# EasyEDA Pro project ProPrj_IRIS_2026-04-30.epro, board PCB1
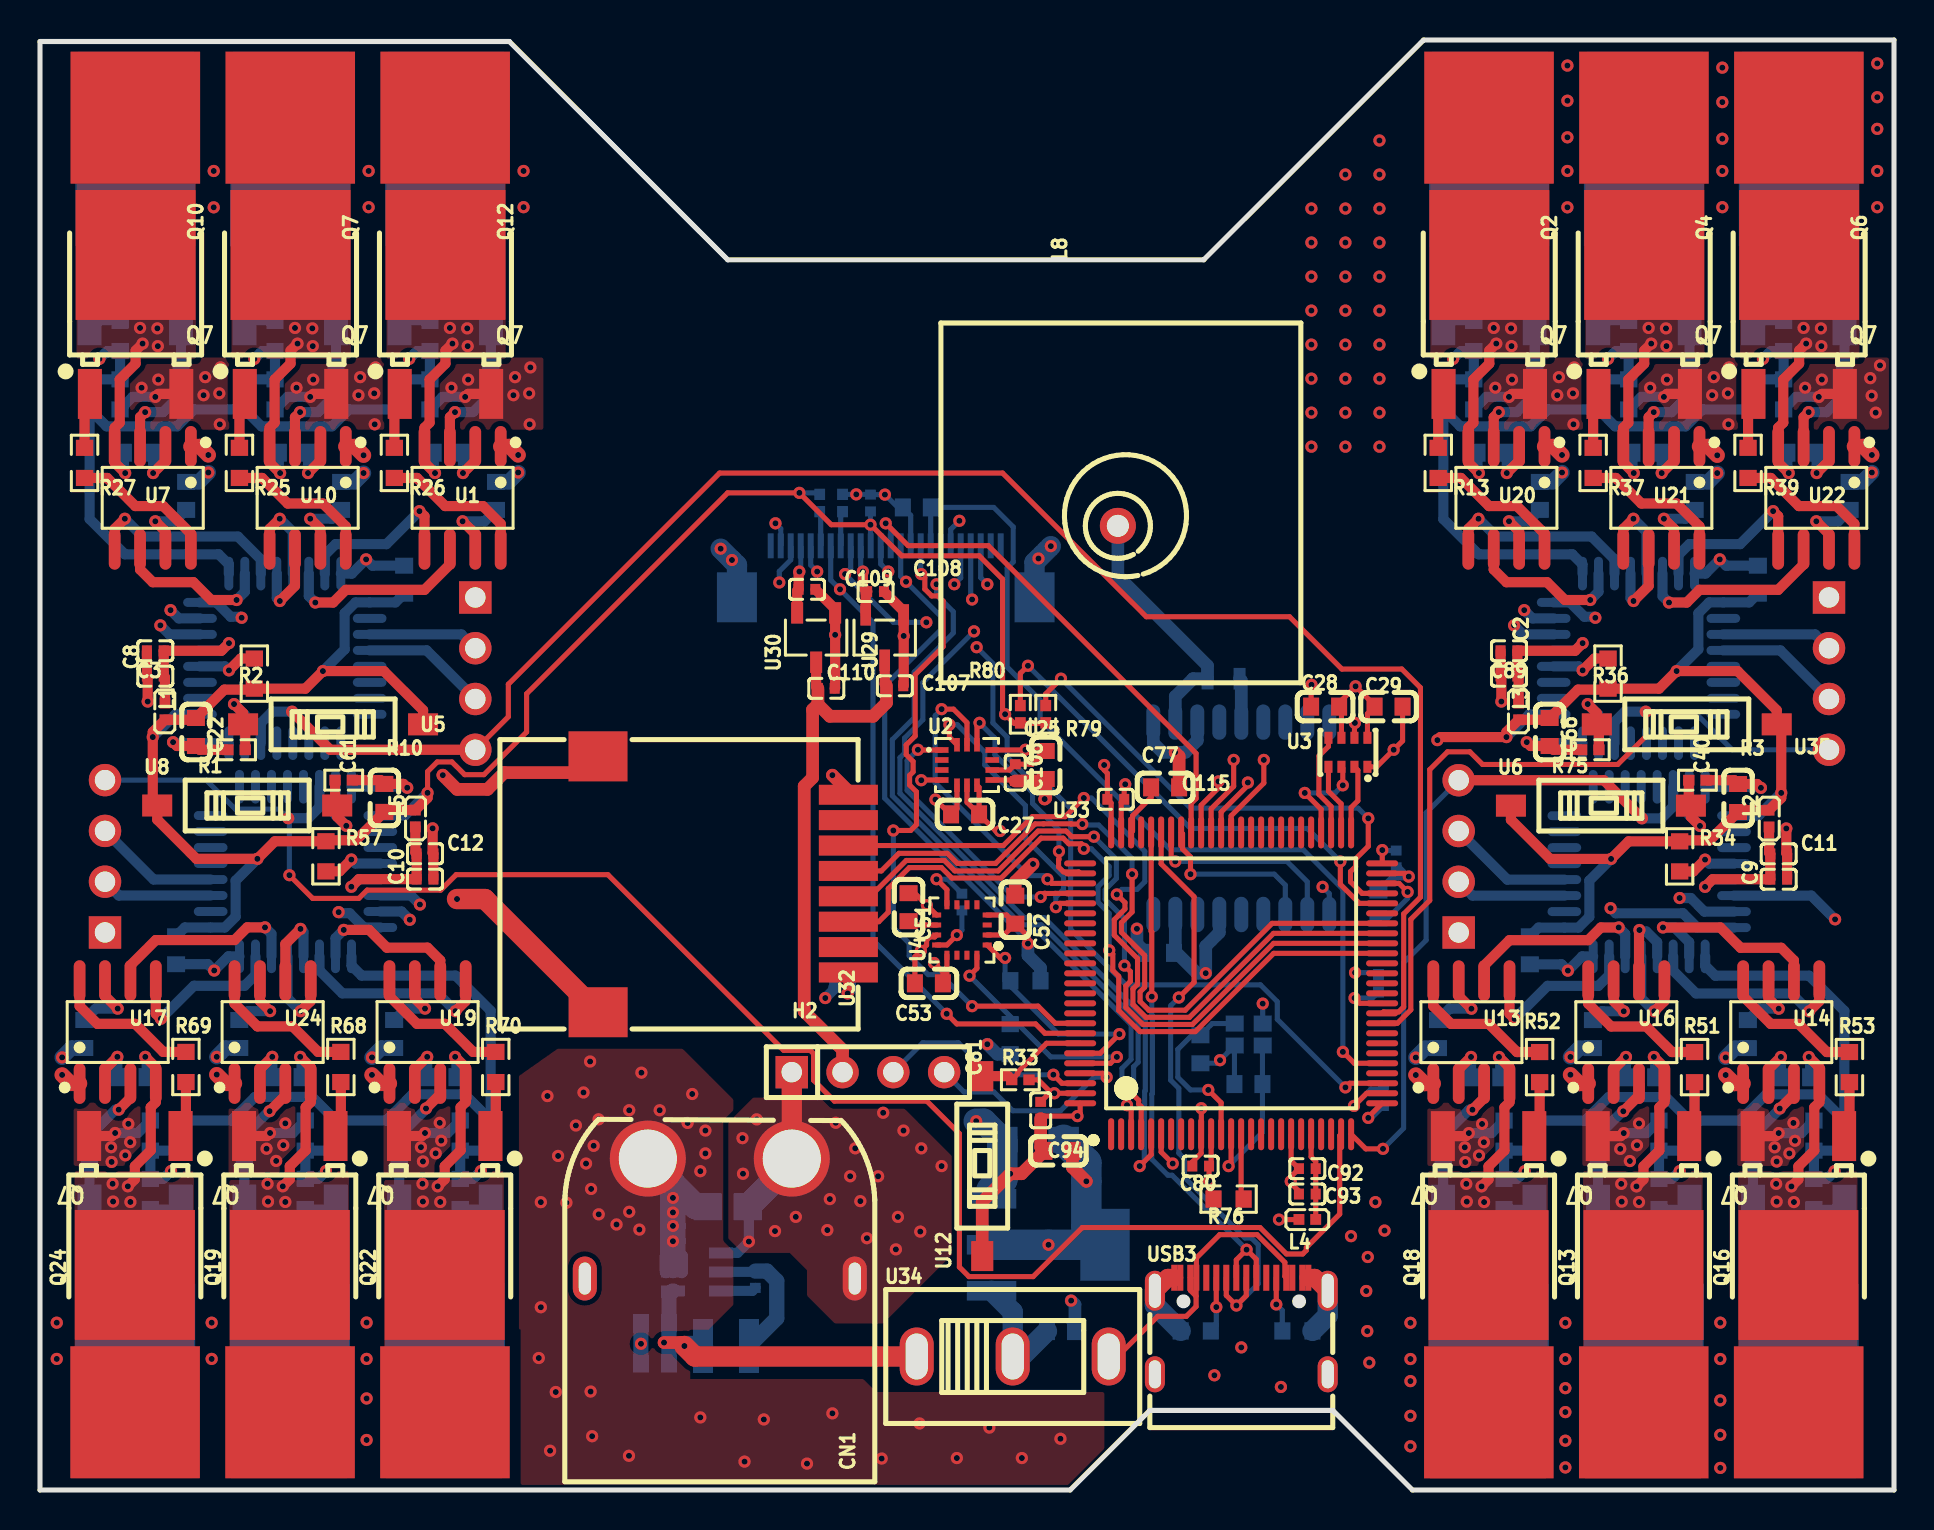
[diagram p2: board, top side]
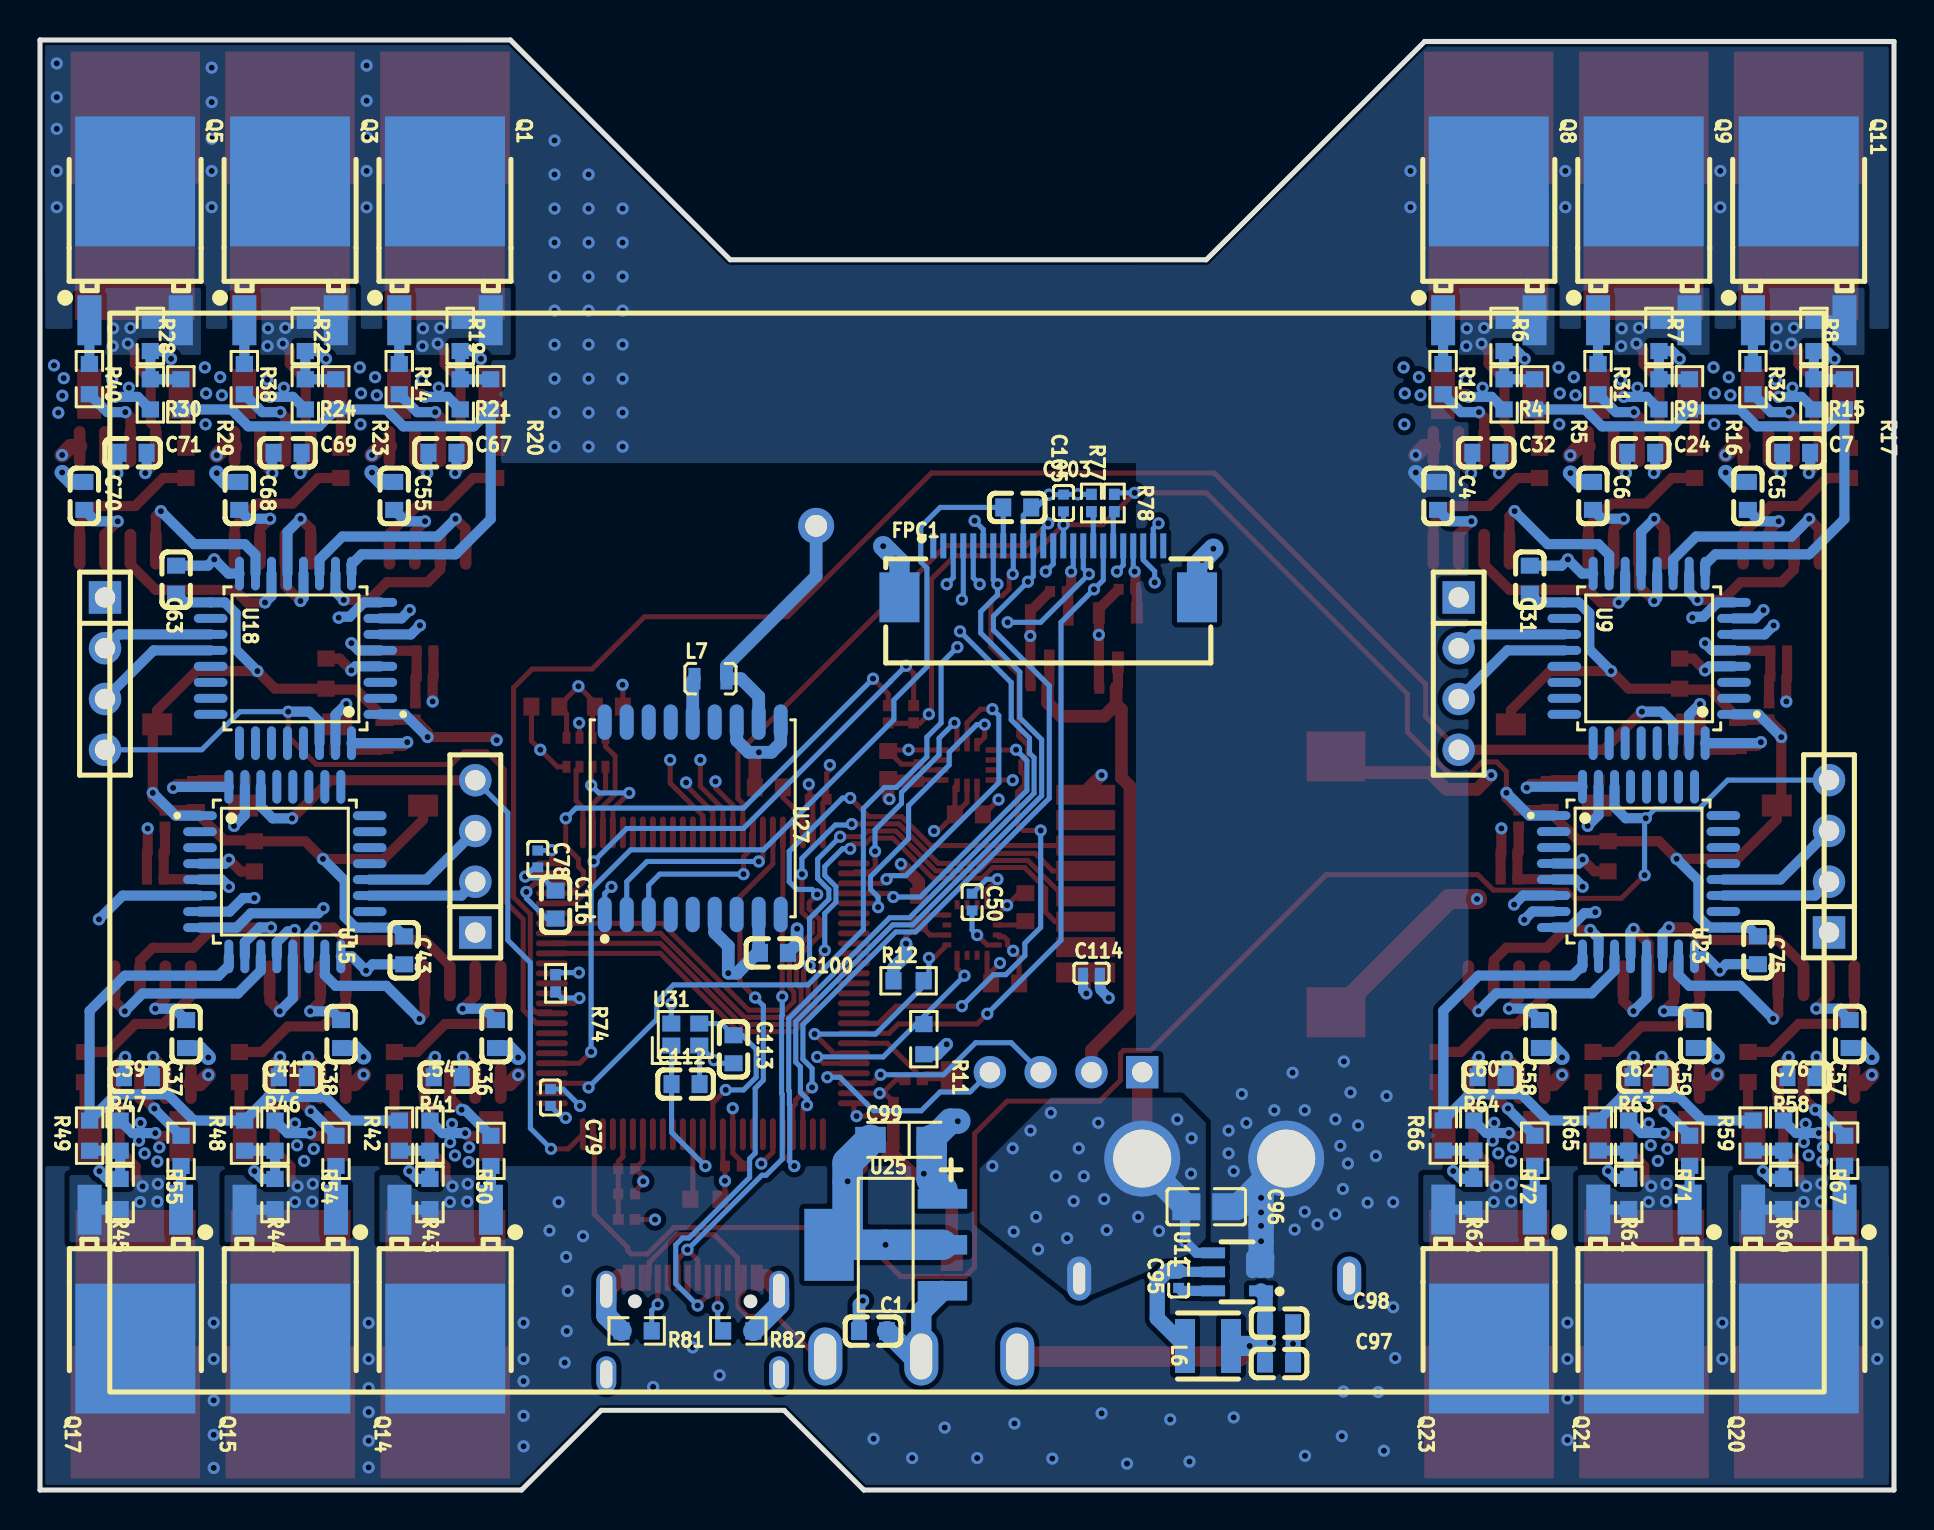
[diagram p3: board, bottom side, seen from below]

Outline 92.71 x 72.54 mm; copper layers: Top Layer, Ground, Power, Bottom Layer. Coordinates in mm from the lower left corner of the outline.
Outline path: 0,72.47 0,0 51.51,0 55.5,3.99 64.64,3.99 68.63,0 92.71,0 92.71,72.54 69.19,72.54 58.19,61.54 34.39,61.54 23.47,72.47 0,72.47
Stack: Top Layer 0.035mm Outer layer thickness 1oz / Dielectric1 0.2104mm 7628 RC49% 8.6mil / Ground 0.0152mm Inner layer thickness / Dielectric2 1.065mm 1.1mm H/HOZ Copper / Power 0.0152mm Inner layer thickness / Dielectric3 0.2104mm 7628 RC49% 8.6mil / Bottom Layer 0.035mm Outer layer thickness 1oz

## Design rules (mm)
template: Custom Config
spacing copperThickness1oz (default): track to track 0.102, other pairs 0.152 to 0.3
spacing copperThickness2oz: track to track 0.203, other pairs 0.152 to 0.3
track width copperThickness1oz (default): min 0.127, default 0.254, max 2.54
track width copperThickness2oz: min 0.203, default 0.254, max 2.54
differential pair differentialPair (default): width min 0.127, default 0.254, max 2.54; gap min 0.152, default 0.152
via viaSize (default): diameter min 0.5, default 0.61, max 10; hole min 0.3, default 0.305, max 6.3
net $1I45112\PHASE_U uses copperRegion1
net $1I45112\PHASE_V uses copperRegion1
net $1I45112\PHASE_W uses copperRegion1
net $1I45134\PHASE_U uses copperRegion1
net $1I45134\PHASE_V uses copperRegion1
net 7.4V_BATTERY uses copperRegion1
net $1I45134\PHASE_W uses copperRegion1
net $1I45156\PHASE_U uses copperRegion1
net $1I45156\PHASE_V uses copperRegion1
net $1I45090\PHASE_U uses copperRegion1
net $1I45090\PHASE_V uses copperRegion1
net $1I45090\PHASE_W uses copperRegion1
net $1I45156\PHASE_W uses copperRegion1
pour e4111 uses copperRegion1
pour e397 uses copperRegion1
pour e182 uses copperRegion1
pour e292 uses copperRegion1
pour e393 uses copperRegion1
pour e1338 uses copperRegion1
pour e470 uses copperRegion1
pour e582 uses copperRegion1
pour e701 uses copperRegion1
pour e838 uses copperRegion1
pour e2081 uses copperRegion1
pour e2207 uses copperRegion1
pour e2186 uses copperRegion1
pour e2269 uses copperRegion1
pour e2267 uses copperRegion1
pour e2268 uses copperRegion1
pour e2460 uses copperRegion1
pour e2478 uses copperRegion1
pour e2486 uses copperRegion1
pour e2530 uses copperRegion1
pour e2531 uses copperRegion1
pour e2532 uses copperRegion1

## Placement (name value [footprint] x y rotation side)
C1  10uF  [C0603]  51.05 7.95 180 bottom
C2  1uF  [C0402]  73.46 41.99 0 top
C3  100nF  [C0402]  5.77 40.72 180 top
C4  10uF  [C0603]  22.8 49.73 90 bottom
C5  10uF  [C0603]  7.31 49.73 90 bottom
C6  10uF  [C0603]  15.05 49.73 90 bottom
C7  100nF  [C0603]  4.89 51.89 0 bottom
C8  1uF  [C0402]  5.77 41.99 0 top
C9  1uF  [C0402]  86.94 30.56 180 top
C10  1uF  [C0402]  19.25 30.56 180 top
C11  100nF  [C0402]  86.94 31.83 0 top
C12  100nF  [C0402]  19.25 31.83 0 top
C22  100nF  [C0603]  7.8 37.92 90 top
C24  100nF  [C0603]  12.64 51.89 0 bottom
C25  2.2uF  [C0603]  50.29 36.27 270 top
C27  10nF  [C0603]  46.26 33.8 180 top
C28  100nF  [C0603]  64.26 39.19 180 top
C29  100nF  [C0603]  67.44 39.19 0 top
C31  100nF  [C0603]  18.21 45.54 90 bottom
C32  100nF  [C0603]  20.39 51.89 0 bottom
C36  10uF  [C0603]  69.91 22.81 270 bottom
C37  10uF  [C0603]  85.4 22.81 270 bottom
C38  10uF  [C0603]  77.66 22.81 270 bottom
C39  100nF  [C0603]  87.82 20.65 180 bottom
C40  100nF  [C0603]  84.91 34.62 270 top
C41  100nF  [C0603]  80.07 20.65 180 bottom
C43  100nF  [C0603]  74.5 27 270 bottom
C50  220nF  [C0402]  46.1 29.41 270 bottom
C51  4.7uF  [C0603]  43.43 29.16 90 top
C52  100nF  [C0603]  48.77 29.03 90 top
C53  100nF  [C0603]  44.45 25.35 180 top
C54  100nF  [C0603]  72.32 20.65 180 bottom
C55  10uF  [C0603]  75 49.73 90 bottom
C57  10uF  [C0603]  2.22 22.81 270 bottom
C58  10uF  [C0603]  17.71 22.81 270 bottom
C59  10uF  [C0603]  9.96 22.81 270 bottom
C60  100nF  [C0603]  20.12 20.65 180 bottom
C61  100nF  [C0603]  17.22 34.62 270 top
C62  100nF  [C0603]  12.38 20.65 180 bottom
C63  100nF  [C0603]  85.9 45.54 90 bottom
C66  100nF  [C0603]  75.49 37.92 90 top
C67  100nF  [C0603]  72.59 51.89 0 bottom
C68  10uF  [C0603]  82.75 49.73 90 bottom
C69  100nF  [C0603]  80.33 51.89 0 bottom
C70  10uF  [C0603]  90.49 49.73 90 bottom
C71  100nF  [C0603]  88.08 51.89 0 bottom
C75  100nF  [C0603]  6.81 27 270 bottom
C76  100nF  [C0603]  4.63 20.65 180 bottom
C77  100nF  [C0402]  53.8 34.55 180 top
C78  100nF  [C0402]  67.82 31.57 90 bottom
C79  100nF  [C0402]  67.18 19.63 90 bottom
C80  100nF  [C0402]  58.04 16.2 0 top
C81  100nF  [C0402]  50.04 19 270 top
C89  100nF  [C0402]  73.46 40.72 180 top
C92  100nF  [C0402]  63.37 16.08 0 top
C93  1uF  [C0402]  63.37 14.81 0 top
C94  4.7uF  [C0603]  50.93 16.97 0 top
C95  100nF  [C0402]  35.77 10.53 270 bottom
C96  10uF  [C0805]  34.39 14.17 180 bottom
C97  22uF  [C0603]  30.75 6.33 0 bottom
C98  22uF  [C0603]  30.75 8.35 0 bottom
C99  10uF  [CAP-SMD_L3.2-W1.6-RD-C7171]  49.65 17.52 0 bottom
C100  10uF  [C0603]  56.01 26.87 0 bottom
C103  15pF  [C0603]  43.85 49.16 0 bottom
C105  100nF  [C0402]  41.53 49.38 270 bottom
C106  100nF  [C0402]  48.77 35.89 90 top
C107  1uF  [C0402]  42.75 40.23 180 top
C108  1uF  [C0402]  41.78 44.95 180 top
C109  1uF  [C0402]  38.35 45.06 180 top
C110  1uF  [C0402]  39.32 40.11 180 top
C112  10pF  [C0603]  60.43 20.31 180 bottom
C113  10pF  [C0603]  58.03 22.05 270 bottom
C114  100nF  [C0402]  40.13 25.86 180 bottom
C115  2.2uF  [C0603]  56.26 35.15 180 top
C116  2.2uF  [C0603]  66.93 29.29 270 bottom
CN1  XT60PW-M  [CONN-TH_XT60PW-M]  33.99 13.58 90 top
FPC1  FPC-05F-24PH20  [FPC-SMD_24P-P0.50_FPC-05F-24PH20]  42.29 45.95 180 bottom
H1  HX PH254-01-04-Z-L11.5 straight pin header  [HDR-TH_4P-HX-PH254-01-04-Z-L11.5]  89.46 40.84 270 bottom
H2  HX PH254-01-04-Z-L11.5 straight pin header  [HDR-TH_4P-HX-PH254-01-04-Z-L11.5]  41.4 20.9 0 top
H3  HX PH254-01-04-Z-L11.5 straight pin header  [HDR-TH_4P-HX-PH254-01-04-Z-L11.5]  21.77 40.84 270 bottom
H4  HX PH254-01-04-Z-L11.5 straight pin header  [HDR-TH_4P-HX-PH254-01-04-Z-L11.5]  70.94 31.7 90 bottom
H5  HX PH254-01-04-Z-L11.5 straight pin header  [HDR-TH_4P-HX-PH254-01-04-Z-L11.5]  3.25 31.7 90 bottom
L1  BLM15PD121SN1D  [L0402]  6.25 38.95 270 top
L2  BLM15PD121SN1D  [L0402]  86.46 33.59 90 top
L3  BLM15PD121SN1D  [L0402]  73.94 38.95 270 top
L4  BLM15PD121SN1D  [L0402]  63.37 13.54 0 top
L5  BLM15PD121SN1D  [L0402]  18.77 33.6 90 top
L6  4.7uH  [IND-SMD_L3.0-W3.0-1]  34.3 7.2 180 bottom
L7  47nH  [IND-SMD_L1.8-W1.0]  59.18 40.59 180 bottom
L8  BWGNSCNX18-18W4  [ANT-TH_L18.0-W18.0_C9900026472]  53.9 48.23 0 top
NOREF  -  [Pad_e4444]  80.2 3.89 0 top
NOREF#2  -  [Pad_e339]  80.21 68.66 180 top
NOREF#3  -  [Pad_e836]  87.95 68.66 180 top
NOREF#4  -  [Pad_e3517]  12.5 3.89 0 top
NOREF#5  -  [Pad_e2994]  20.26 68.66 180 top
NOREF#6  -  [Pad_e4442]  72.45 3.89 0 top
NOREF#7  -  [Pad_e680]  72.46 68.66 180 top
NOREF#8  -  [Pad_e4443]  87.94 3.89 0 top
NOREF#9  -  [Pad_e3516]  20.25 3.89 0 top
NOREF#10  -  [Pad_e2995]  4.77 68.66 180 top
NOREF#11  -  [Pad_e3514]  4.76 3.89 0 top
NOREF#12  -  [Pad_e2996]  12.51 68.66 180 top
Q1  IRLR7843TRPBF  [TO-252-3_L6.6-W6.1-P4.57-LS9.9-BR-CW]  72.46 61.99 270 bottom
Q2  IRLR7843TRPBF  [TO-252-3_L6.6-W6.1-P4.57-LS9.9-BR-CW]  72.47 58.31 270 top
Q3  IRLR7843TRPBF  [TO-252-3_L6.6-W6.1-P4.57-LS9.9-BR-CW]  80.21 61.99 270 bottom
Q4  IRLR7843TRPBF  [TO-252-3_L6.6-W6.1-P4.57-LS9.9-BR-CW]  80.22 58.31 270 top
Q5  IRLR7843TRPBF  [TO-252-3_L6.6-W6.1-P4.57-LS9.9-BR-CW]  87.95 61.99 270 bottom
Q6  IRLR7843TRPBF  [TO-252-3_L6.6-W6.1-P4.57-LS9.9-BR-CW]  87.97 58.31 270 top
Q7  IRLR7843TRPBF  [TO-252-3_L6.6-W6.1-P4.57-LS9.9-BR-CW]  12.53 58.31 270 top
Q8  IRLR7843TRPBF  [TO-252-3_L6.6-W6.1-P4.57-LS9.9-BR-CW]  20.26 61.99 270 bottom
Q9  IRLR7843TRPBF  [TO-252-3_L6.6-W6.1-P4.57-LS9.9-BR-CW]  12.51 61.99 270 bottom
Q10  IRLR7843TRPBF  [TO-252-3_L6.6-W6.1-P4.57-LS9.9-BR-CW]  4.78 58.31 270 top
Q11  IRLR7843TRPBF  [TO-252-3_L6.6-W6.1-P4.57-LS9.9-BR-CW]  4.77 61.99 270 bottom
Q12  IRLR7843TRPBF  [TO-252-3_L6.6-W6.1-P4.57-LS9.9-BR-CW]  20.28 58.31 270 top
Q13  IRLR7843TRPBF  [TO-252-3_L6.6-W6.1-P4.57-LS9.9-BR-CW]  80.18 14.23 90 top
Q14  IRLR7843TRPBF  [TO-252-3_L6.6-W6.1-P4.57-LS9.9-BR-CW]  72.45 10.55 90 bottom
Q15  IRLR7843TRPBF  [TO-252-3_L6.6-W6.1-P4.57-LS9.9-BR-CW]  80.2 10.55 90 bottom
Q16  IRLR7843TRPBF  [TO-252-3_L6.6-W6.1-P4.57-LS9.9-BR-CW]  87.93 14.23 90 top
Q17  IRLR7843TRPBF  [TO-252-3_L6.6-W6.1-P4.57-LS9.9-BR-CW]  87.94 10.55 90 bottom
Q18  IRLR7843TRPBF  [TO-252-3_L6.6-W6.1-P4.57-LS9.9-BR-CW]  72.44 14.23 90 top
Q19  IRLR7843TRPBF  [TO-252-3_L6.6-W6.1-P4.57-LS9.9-BR-CW]  12.49 14.24 90 top
Q20  IRLR7843TRPBF  [TO-252-3_L6.6-W6.1-P4.57-LS9.9-BR-CW]  4.76 10.55 90 bottom
Q21  IRLR7843TRPBF  [TO-252-3_L6.6-W6.1-P4.57-LS9.9-BR-CW]  12.5 10.55 90 bottom
Q22  IRLR7843TRPBF  [TO-252-3_L6.6-W6.1-P4.57-LS9.9-BR-CW]  20.24 14.24 90 top
Q23  IRLR7843TRPBF  [TO-252-3_L6.6-W6.1-P4.57-LS9.9-BR-CW]  20.25 10.55 90 bottom
Q24  IRLR7843TRPBF  [TO-252-3_L6.6-W6.1-P4.57-LS9.9-BR-CW]  4.74 14.24 90 top
R1  10kΩ  [R0402]  9.83 37.03 180 top
R2  10kΩ  [R0603]  10.72 40.84 90 top
R3  10kΩ  [R0402]  82.88 35.51 0 top
R4  10kΩ  [R0603]  19.5 54.81 90 bottom
R5  33kΩ  [R0603]  17.98 54.81 90 bottom
R6  33kΩ  [R0603]  19.5 57.73 90 bottom
R7  33kΩ  [R0603]  11.75 57.73 90 bottom
R8  33kΩ  [R0603]  4.01 57.73 90 bottom
R9  10kΩ  [R0603]  11.75 54.81 90 bottom
R10  10kΩ  [R0402]  15.19 35.51 0 top
R11  2.2kΩ  [R0603]  48.51 22.55 90 bottom
R12  2.2kΩ  [R0603]  49.28 25.48 180 bottom
R13  100Ω  [R0603]  69.92 51.38 90 top
R14  100Ω  [R0603]  74.74 55.57 90 bottom
R15  10kΩ  [R0603]  4.01 54.81 90 bottom
R16  33kΩ  [R0603]  10.23 54.81 90 bottom
R17  33kΩ  [R0603]  2.48 54.81 90 bottom
R18  100Ω  [R0603]  22.55 55.57 90 bottom
R19  33kΩ  [R0603]  71.7 57.73 90 bottom
R20  33kΩ  [R0603]  70.17 54.81 90 bottom
R21  10kΩ  [R0603]  71.7 54.81 90 bottom
R22  33kΩ  [R0603]  79.44 57.73 90 bottom
R23  33kΩ  [R0603]  77.92 54.81 90 bottom
R24  10kΩ  [R0603]  79.44 54.81 90 bottom
R25  100Ω  [R0603]  9.97 51.38 90 top
R26  100Ω  [R0603]  17.72 51.38 90 top
R27  100Ω  [R0603]  2.23 51.38 90 top
R28  33kΩ  [R0603]  87.19 57.73 90 bottom
R29  33kΩ  [R0603]  85.67 54.81 90 bottom
R30  10kΩ  [R0603]  87.19 54.81 90 bottom
R31  100Ω  [R0603]  14.8 55.57 90 bottom
R32  100Ω  [R0603]  7.05 55.57 90 bottom
R33  10kΩ  [R0402]  49.02 20.52 0 top
R34  10kΩ  [R0603]  81.99 31.7 270 top
R36  10kΩ  [R0603]  78.41 40.84 90 top
R37  100Ω  [R0603]  77.67 51.38 90 top
R38  100Ω  [R0603]  82.49 55.57 90 bottom
R39  100Ω  [R0603]  85.41 51.38 90 top
R40  100Ω  [R0603]  90.24 55.57 90 bottom
R41  10kΩ  [R0603]  73.21 17.73 270 bottom
R42  33kΩ  [R0603]  74.73 17.73 270 bottom
R43  33kΩ  [R0603]  73.21 14.81 270 bottom
R44  33kΩ  [R0603]  80.96 14.81 270 bottom
R45  33kΩ  [R0603]  88.7 14.81 270 bottom
R46  10kΩ  [R0603]  80.96 17.73 270 bottom
R47  10kΩ  [R0603]  88.7 17.73 270 bottom
R48  33kΩ  [R0603]  82.48 17.73 270 bottom
R49  33kΩ  [R0603]  90.23 17.73 270 bottom
R50  100Ω  [R0603]  70.16 16.97 270 bottom
R51  100Ω  [R0603]  82.74 21.16 270 top
R52  100Ω  [R0603]  74.99 21.16 270 top
R53  100Ω  [R0603]  90.48 21.16 270 top
R54  100Ω  [R0603]  77.91 16.97 270 bottom
R55  100Ω  [R0603]  85.66 16.97 270 bottom
R57  10kΩ  [R0603]  14.3 31.7 270 top
R58  10kΩ  [R0603]  5.52 17.73 270 bottom
R59  33kΩ  [R0603]  7.04 17.73 270 bottom
R60  33kΩ  [R0603]  5.52 14.81 270 bottom
R61  33kΩ  [R0603]  13.27 14.81 270 bottom
R62  33kΩ  [R0603]  21.01 14.81 270 bottom
R63  10kΩ  [R0603]  13.27 17.73 270 bottom
R64  10kΩ  [R0603]  21.01 17.73 270 bottom
R65  33kΩ  [R0603]  14.79 17.73 270 bottom
R66  33kΩ  [R0603]  22.54 17.73 270 bottom
R67  100Ω  [R0603]  2.47 16.97 270 bottom
R68  100Ω  [R0603]  15.04 21.16 270 top
R69  100Ω  [R0603]  7.3 21.16 270 top
R70  100Ω  [R0603]  22.79 21.16 270 top
R71  100Ω  [R0603]  10.22 16.97 270 bottom
R72  100Ω  [R0603]  17.97 16.97 270 bottom
R74  10kΩ  [R0402]  66.93 25.35 90 bottom
R75  10kΩ  [R0402]  77.52 37.03 180 top
R76  10kΩ  [R0603]  59.44 14.55 0 top
R77  1kΩ  [R0402]  40.13 49.38 270 bottom
R78  4.7kΩ  [R0402]  38.99 49.38 270 bottom
R79  4.7kΩ  [R0402]  50.29 38.81 90 top
R80  4.7kΩ  [R0402]  49.02 38.81 90 top
R81  5.1kΩ  [R0603]  62.88 7.96 0 bottom
R82  5.1kΩ  [R0603]  57.8 7.96 0 bottom
U1  MIC4604YM-TR  [SOIC-8_L4.9-W3.9-P1.27-LS6.0-BL]  21.13 49.64 180 top
U2  ICM-42688-P  [LGA-14_L3.0-W2.5-P0.50-TL]  46.36 36.27 0 top
U3  BMP280  [LGA-8_L2.5-W2.0-P0.65_AMP6127]  65.41 36.91 270 top
U4  QMC5883L  [LGA-16_L3.0-W3.0-P0.50-BL_SQ]  46.1 28.02 90 top
U5  2.54-1P TPGT  [SW-SMD_2P-L6.2-W2.5-LS9.4]  14.66 38.3 180 top
U6  2.54-1P TPGT  [SW-SMD_2P-L6.2-W2.5-LS9.4]  78.05 34.24 0 top
U7  MIC4604YM-TR  [SOIC-8_L4.9-W3.9-P1.27-LS6.0-BL]  5.64 49.64 180 top
U8  2.54-1P TPGT  [SW-SMD_2P-L6.2-W2.5-LS9.4]  10.36 34.24 0 top
U9  AT32F421K8T7  [LQFP-32_L7.0-W7.0-P0.80-LS9.0-BL]  12.24 41.6 90 bottom
U10  MIC4604YM-TR  [SOIC-8_L4.9-W3.9-P1.27-LS6.0-BL]  13.39 49.64 180 top
U11  AP63205WU-7  [TSOT-23-6_L2.9-W1.6-P0.95-LS2.8-BL]  32.85 10.91 90 bottom
U12  2.54-1P TPGT  [SW-SMD_2P-L6.2-W2.5-LS9.4]  47.12 16.2 90 top
U13  MIC4604YM-TR  [SOIC-8_L4.9-W3.9-P1.27-LS6.0-BL]  71.58 22.91 0 top
U14  MIC4604YM-TR  [SOIC-8_L4.9-W3.9-P1.27-LS6.0-BL]  87.07 22.91 0 top
U15  AT32F421K8T7  [LQFP-32_L7.0-W7.0-P0.80-LS9.0-BL]  80.47 30.94 270 bottom
U16  MIC4604YM-TR  [SOIC-8_L4.9-W3.9-P1.27-LS6.0-BL]  79.33 22.91 0 top
U17  MIC4604YM-TR  [SOIC-8_L4.9-W3.9-P1.27-LS6.0-BL]  3.89 22.91 0 top
U18  AT32F421K8T7  [LQFP-32_L7.0-W7.0-P0.80-LS9.0-BL]  79.93 41.6 90 bottom
U19  MIC4604YM-TR  [SOIC-8_L4.9-W3.9-P1.27-LS6.0-BL]  19.38 22.91 0 top
U20  MIC4604YM-TR  [SOIC-8_L4.9-W3.9-P1.27-LS6.0-BL]  73.33 49.64 180 top
U21  MIC4604YM-TR  [SOIC-8_L4.9-W3.9-P1.27-LS6.0-BL]  81.08 49.64 180 top
U22  MIC4604YM-TR  [SOIC-8_L4.9-W3.9-P1.27-LS6.0-BL]  88.82 49.64 180 top
U23  AT32F421K8T7  [LQFP-32_L7.0-W7.0-P0.80-LS9.0-BL]  12.78 30.94 270 bottom
U24  MIC4604YM-TR  [SOIC-8_L4.9-W3.9-P1.27-LS6.0-BL]  11.63 22.91 0 top
U25  MIC39100-3.3WS-TR  [SOT-223-4_L6.5-W3.5-P2.30-LS7.0-BR]  50.42 12.27 180 bottom
U27  ATGM336H-5N31  [GPSM-SMD_ATGM336H-TR]  60.07 33.6 0 bottom
U29  XC6206-1.2V  [SOT-23-3_L3.0-W1.6-P1.90-LS2.8-BR]  42.24 42.65 90 top
U30  XC6206-2.8V  [SOT-23-3_L2.9-W1.6-P1.90-LS2.8-BR]  38.81 42.65 90 top
U31  48MHz  [CRYSTAL-SMD_4P-L2.0-W1.6-BL]  60.44 22.79 180 bottom
U32  E01C-ML01SP4  [COMM-SMD_E01C-ML01SP4]  34.16 30.3 270 top
U33  STM32H743VIT6  [LQFP-100_L14.0-W14.0-P0.50-LS16.0-BL]  59.56 25.35 0 top
U34  SS12D10G5  [SW-TH_SHOU-HAN_SS12D10G4]  48.64 6.68 0 top
U35  2.54-1P TPGT  [SW-SMD_2P-L6.2-W2.5-LS9.4]  82.35 38.3 180 top
USB3  -  [USB-C-SMD_KH-TYPE-C-16P]  60.07 8.2 0 top

## Footprints (pads in the part's own frame, mm; a bottom-side part is the same pattern mirrored in y, then rotated)
ANT-TH_L18.0-W18.0_C9900026472
  round 1.8 hole 1.1: 1(0,0)
C0402
  rect 0.5x0.54 smd: 1(-0.42,0) 2(0.42,0)
C0603
  rect 0.8x0.9 smd: 1(-0.7,0) 2(0.7,0)
C0805
  rect 1.41x1.35 smd: 1(-1,0) 2(1,0)
CAP-SMD_L3.2-W1.6-RD-C7171
  rect 1.53x1.296 smd: 1(-1.53,0) 2(1.53,0)
COMM-SMD_E01C-ML01SP4
  rect 1x2.95 smd: 1(4.41,6.26) 2(3.14,6.26) 3(1.87,6.26) 4(0.6,6.26) 5(-0.67,6.26) 6(-1.94,6.26) 7(-3.21,6.26) 8(-4.48,6.26)
  rect 2.5x2.95 smd: 9(-6.4,-6.26) 10(6.4,-6.255)
CONN-TH_XT60PW-M
  round 3.8 hole 2.9: 1(3,-3.6) 2(3,3.6)
  oval 2.2x1.2 hole 1.6x0.6: 3(-3,6.75) 4(-3,-6.75)
CRYSTAL-SMD_4P-L2.0-W1.6-BL
  rect 0.9x0.8 smd: 1(-0.7,-0.55) 2(0.7,-0.55) 3(0.7,0.55) 4(-0.7,0.55)
FPC-SMD_24P-P0.50_FPC-05F-24PH20
  rect 0.3x1.25 smd: 1(-5.75,1.288) 2(-5.25,1.288) 3(-4.75,1.288) 4(-4.25,1.288) 5(-3.75,1.288) 6(-3.25,1.288) 7(-2.75,1.288) 8(-2.25,1.288) 9(-1.75,1.288) 10(-1.25,1.288) 11(-0.75,1.288) 12(-0.25,1.288) 13(0.25,1.288) 14(0.75,1.288) 15(1.25,1.288) 16(1.75,1.288) 17(2.25,1.288) 18(2.75,1.288) 19(3.25,1.288) 20(3.75,1.288) 21(4.25,1.288) 22(4.75,1.288) 23(5.25,1.288) 24(5.75,1.288)
  rect 2x2.5 smd: 25(7.44,-1.288) 26(-7.44,-1.288)
GPSM-SMD_ATGM336H-TR
  oval 0.7x1.773 smd: 1(4.4,4.811) 2(3.3,4.811) 3(2.2,4.811) 4(1.1,4.811) 5(0,4.811) 6(-1.1,4.811) 7(-2.2,4.811) 8(-3.3,4.811) 9(-4.4,4.811) 10(-4.4,-4.811) 11(-3.3,-4.811) 12(-2.2,-4.811) 13(-1.1,-4.811) 14(0,-4.811) 15(1.1,-4.811) 16(2.2,-4.811) 17(3.3,-4.811) 18(4.4,-4.811)
HDR-TH_4P-HX-PH254-01-04-Z-L11.5
  rect 1.62x1.62 hole 1.02: 1(-3.81,0)
  round 1.62 hole 1.02: 2(-1.27,0) 3(1.27,0) 4(3.81,0)
IND-SMD_L1.8-W1.0
  rect 0.6x1.08 smd: 1(-0.8,0) 2(0.8,0)
IND-SMD_L3.0-W3.0-1
  rect 1x2.7 smd: 1(-1.15,0) 2(1.15,0)
L0402
  rect 0.54x0.54 smd: 1(-0.42,0) 2(0.42,0)
LGA-8_L2.5-W2.0-P0.65_AMP6127
  rect 0.6x0.4 smd: 1(0.725,0.975) 2(0.725,0.325) 3(0.725,-0.325) 4(0.725,-0.975) 5(-0.725,-0.975) 6(-0.725,-0.325) 7(-0.725,0.325) 8(-0.725,0.975)
LGA-14_L3.0-W2.5-P0.50-TL
  rect 0.675x0.28 smd: 1(-1.262,0.75) 2(-1.262,0.25) 3(-1.262,-0.25) 4(-1.262,-0.75) 8(1.262,-0.75) 9(1.262,-0.25) 10(1.262,0.25) 11(1.262,0.75)
  rect 0.28x0.675 smd: 5(-0.5,-1.012) 6(0,-1.012) 7(0.5,-1.012) 12(0.5,1.012) 13(0,1.012) 14(-0.5,1.012)
LGA-16_L3.0-W3.0-P0.50-BL_SQ
  rect 0.25x0.45 smd: 1(-0.75,-1.263) 2(-0.25,-1.263) 3(0.25,-1.263) 4(0.75,-1.263) 9(0.75,1.263) 10(0.25,1.263) 11(-0.25,1.263) 12(-0.75,1.263)
  rect 0.45x0.25 smd: 5(1.263,-0.75) 6(1.263,-0.25) 7(1.263,0.25) 8(1.263,0.75) 13(-1.263,0.75) 14(-1.263,0.25) 15(-1.263,-0.25) 16(-1.263,-0.75)
LQFP-32_L7.0-W7.0-P0.80-LS9.0-BL
  oval 0.448x1.684 smd: 1(-2.8,-4.242) 2(-2,-4.242) 3(-1.2,-4.242) 4(-0.4,-4.242) 5(0.4,-4.242) 6(1.2,-4.242) 7(2,-4.242) 8(2.8,-4.242) 17(2.8,4.242) 18(2,4.242) 19(1.2,4.242) 20(0.4,4.242) 21(-0.4,4.242) 22(-1.2,4.242) 23(-2,4.242) 24(-2.8,4.242)
  oval 1.684x0.448 smd: 9(4.242,-2.8) 10(4.242,-2) 11(4.242,-1.2) 12(4.242,-0.4) 13(4.242,0.4) 14(4.242,1.2) 15(4.242,2) 16(4.242,2.8) 25(-4.242,2.8) 26(-4.242,2) 27(-4.242,1.2) 28(-4.242,0.4) 29(-4.242,-0.4) 30(-4.242,-1.2) 31(-4.242,-2) 32(-4.242,-2.8)
LQFP-100_L14.0-W14.0-P0.50-LS16.0-BL
  oval 0.3x1.6 smd: 1(-6,-7.55) 2(-5.5,-7.55) 3(-5,-7.55) 4(-4.5,-7.55) 5(-4,-7.55) 6(-3.5,-7.55) 7(-3,-7.55) 8(-2.5,-7.55) 9(-2,-7.55) 10(-1.5,-7.55) 11(-1,-7.55) 12(-0.5,-7.55) 13(0,-7.55) 14(0.5,-7.55) 15(1,-7.55) 16(1.5,-7.55) 17(2,-7.55) 18(2.5,-7.55) 19(3,-7.55) 20(3.5,-7.55) 21(4,-7.55) 22(4.5,-7.55) 23(5,-7.55) 24(5.5,-7.55) 25(6,-7.55) 51(6,7.55) 52(5.5,7.55) 53(5,7.55) 54(4.5,7.55) 55(4,7.55) 56(3.5,7.55) 57(3,7.55) 58(2.5,7.55) 59(2,7.55) 60(1.5,7.55) 61(1,7.55) 62(0.5,7.55) 63(0,7.55) 64(-0.5,7.55) 65(-1,7.55) 66(-1.5,7.55) 67(-2,7.55) 68(-2.5,7.55) 69(-3,7.55) 70(-3.5,7.55) 71(-4,7.55) 72(-4.5,7.55) 73(-5,7.55) 74(-5.5,7.55) 75(-6,7.55)
  oval 1.6x0.3 smd: 26(7.55,-6) 27(7.55,-5.5) 28(7.55,-5) 29(7.55,-4.5) 30(7.55,-4) 31(7.55,-3.5) 32(7.55,-3) 33(7.55,-2.5) 34(7.55,-2) 35(7.55,-1.5) 36(7.55,-1) 37(7.55,-0.5) 38(7.55,0) 39(7.55,0.5) 40(7.55,1) 41(7.55,1.5) 42(7.55,2) 43(7.55,2.5) 44(7.55,3) 45(7.55,3.5) 46(7.55,4) 47(7.55,4.5) 48(7.55,5) 49(7.55,5.5) 50(7.55,6) 76(-7.55,6) 77(-7.55,5.5) 78(-7.55,5) 79(-7.55,4.5) 80(-7.55,4) 81(-7.55,3.5) 82(-7.55,3) 83(-7.55,2.5) 84(-7.55,2) 85(-7.55,1.5) 86(-7.55,1) 87(-7.55,0.5) 88(-7.55,0) 89(-7.55,-0.5) 90(-7.55,-1) 91(-7.55,-1.5) 92(-7.55,-2) 93(-7.55,-2.5) 94(-7.55,-3) 95(-7.55,-3.5) 96(-7.55,-4) 97(-7.55,-4.5) 98(-7.55,-5) 99(-7.55,-5.5) 100(-7.55,-6)
Pad_e339
  custom 6.477x6.604 smd: 1(0,0)
Pad_e680
  custom 6.477x6.604 smd: 1(0,0)
Pad_e836
  custom 6.477x6.604 smd: 1(0,0)
Pad_e2994
  custom 6.477x6.604 smd: 1(0,0)
Pad_e2995
  custom 6.477x6.604 smd: 1(0,0)
Pad_e2996
  custom 6.477x6.604 smd: 1(0,0)
Pad_e3514
  custom 6.477x6.604 smd: 1(0,0)
Pad_e3516
  custom 6.477x6.604 smd: 1(0,0)
Pad_e3517
  custom 6.477x6.604 smd: 1(0,0)
Pad_e4442
  custom 6.477x6.604 smd: 1(0,0)
Pad_e4443
  custom 6.477x6.604 smd: 1(0,0)
Pad_e4444
  custom 6.477x6.604 smd: 1(0,0)
R0402
  rect 0.566x0.54 smd: 1(-0.433,0) 2(0.433,0)
R0603
  rect 0.806x0.864 smd: 1(-0.753,0) 2(0.753,0)
SOIC-8_L4.9-W3.9-P1.27-LS6.0-BL
  oval 0.588x2.045 smd: 1(-1.905,-2.57) 2(-0.635,-2.57) 3(0.635,-2.57) 4(1.905,-2.57) 5(1.905,2.57) 6(0.635,2.57) 7(-0.635,2.57) 8(-1.905,2.57)
SOT-23-3_L2.9-W1.6-P1.90-LS2.8-BR
  rect 1.07x0.6 smd: 1(1.235,-0.95) 2(1.235,0.95) 3(-1.235,0)
SOT-23-3_L3.0-W1.6-P1.90-LS2.8-BR
  rect 1.07x0.532 smd: 1(1.135,-0.95) 2(1.135,0.95) 3(-1.135,0)
SOT-223-4_L6.5-W3.5-P2.30-LS7.0-BR
  rect 2.47x0.98 smd: 1(2.835,-2.3) 2(2.835,0) 3(2.835,2.3)
  rect 2.47x3.6 smd: 4(-2.835,0)
SW-SMD_2P-L6.2-W2.5-LS9.4
  rect 1.5x1.1 smd: 1(-4.5,0) 2(4.5,0)
SW-TH_SHOU-HAN_SS12D10G4
  oval 1.7x2.9 hole 1.1x2.3: 1(-4.8,0) 2(0,0) 3(4.8,0)
TO-252-3_L6.6-W6.1-P4.57-LS9.9-BR-CW
  rect 2.5x1.2 smd: 1(3.475,-2.286) 3(3.475,2.286)
  rect 6.5x6 smd: 2(-3.475,0)
TSOT-23-6_L2.9-W1.6-P0.95-LS2.8-BL
  rect 0.55x1.2 smd: 1(-0.95,-1.2) 2(0,-1.2) 3(0.95,-1.2) 4(0.95,1.2) 5(0,1.2) 6(-0.95,1.2)
USB-C-SMD_KH-TYPE-C-16P
  oval 1x2 hole 0.6x1.7: 1(-4.32,1.765) 2(4.32,1.765)
  oval 1x1.8 hole 0.6x1.4: 3(-4.32,-2.415) 4(4.32,-2.415)
  rect 0.3x1.3 smd: A1(-3.35,2.415) A4(-2.55,2.415) A5(-1.25,2.415) A6(-0.25,2.415) A7(0.25,2.415) A8(1.25,2.415) A9(2.55,2.415) A12(3.35,2.415) B1(3.05,2.415) B4(2.25,2.415) B5(1.75,2.415) B6(0.75,2.415) B7(-0.75,2.415) B8(-1.75,2.415) B9(-2.25,2.415) B12(-3.05,2.415)

## Nets
1.2V: C108.2 FPC1.15 U29.2
2.8V: C109.2 FPC1.21 U30.2
3V3: C22.2 C25.2 C27.2 C28.1 C29.1 C31.1 C40.2 C43.1 C52.1 C53.1 C61.2 C63.1 C66.2 C75.1 C77.2 C78.2 C79.2 C80.2 C81.2 C94.1 C99.1 C100.2 C105.2 C106.1 C114.1 FPC1.14 L1.2 L2.2 L3.2 L4.1 L5.2 R2.1 R11.1 R12.1 R34.1 R36.1 R57.1 R76.1 R78.1 R79.1 R80.1 U2.5 U2.8 U3.6 U3.8 U4.2 U4.4 U4.13 U5.1 U6.1 U8.1 U9.1 U9.17 U12.1 U15.1 U15.17 U18.1 U18.17 U23.1 U23.17 U25.3 U27.6 U27.8 U32.1 U33.6 U33.11 U33.27 U33.50 U33.75 U33.100 U35.1
5V_USB: U34.3 USB3.A4 USB3.A9 USB3.B4 USB3.B9
7.4V_BATTERY: C4.2 C5.2 C6.2 C36.2 C37.2 C38.2 C55.2 C57.2 C58.2 C59.2 C68.2 C70.2 C96.2 CN1.2 Q1.2 Q3.2 Q5.2 Q8.2 Q9.2 Q11.2 Q14.2 Q15.2 Q17.2 Q20.2 Q21.2 Q23.2 U1.1 U7.1 U10.1 U11.2 U11.3 U13.1 U14.1 U16.1 U17.1 U19.1 U20.1 U21.1 U22.1 U24.1
+5V: C1.2 C107.2 C110.2 H2.2 U25.1 U29.3 U30.3 U34.2
GND: C1.1 C2.1 C3.2 C4.1 C5.1 C6.1 C8.1 C9.1 C10.1 C11.2 C12.2 C22.1 C25.1 C27.1 C28.2 C29.2 C31.2 C36.1 C37.1 C38.1 C40.1 C43.2 C51.2 C52.2 C53.2 C55.1 C57.1 C58.1 C59.1 C61.1 C63.2 C66.1 C68.1 C70.1 C75.2 C77.1 C78.1 C79.1 C80.1 C81.1 C89.2 C92.1 C93.1 C94.2 C96.1 C97.1 C98.1 C99.2 C100.1 C103.1 C105.1 C106.2 C107.1 C108.1 C109.1 C110.1 C112.2 C113.2 C114.2 C115.1 C116.1 CN1.1 CN1.3 CN1.4 FPC1.10 FPC1.23 FPC1.25 FPC1.26 H1.1 H2.1 H3.1 H4.1 H5.1 Q2.3 Q4.3 Q6.3 Q7.3 Q10.3 Q12.3 Q13.3 Q16.3 Q18.3 Q19.3 Q22.3 Q24.3 R1.2 R3.2 R4.1 R9.1 R10.2 R15.1 R21.1 R24.1 R30.1 R33.2 R41.1 R46.1 R47.1 R58.1 R63.1 R64.1 R74.2 R75.2 R77.1 R81.2 R82.1 U1.7 U2.6 U2.7 U2.9 U2.11 U3.1 U3.7 U4.9 U4.11 U7.7 U9.16 U9.32 U10.7 U11.4 U13.7 U14.7 U15.16 U15.32 U16.7 U17.7 U18.16 U18.32 U19.7 U20.7 U21.7 U22.7 U23.16 U23.32 U24.7 U25.2 U25.4 U27.1 U27.10 U27.12 U29.1 U30.1 U31.2 U31.4 U32.8 U32.9 U32.10 U33.10 U33.19 U33.26 U33.49 U33.74 U33.99 USB3.1 USB3.2 USB3.3 USB3.4 USB3.A1 USB3.A12 USB3.B1 USB3.B12
VDDA: C92.2 C93.2 L4.2 U33.21
$1I45090\$1N2344: Q5.1 R40.2
$1I45090\$1N2345: R40.1 U22.3
$1I45090\$1N2351: R37.1 U21.8
$1I45090\$1N2352: Q4.1 R37.2
$1I45090\$1N2355: C69.2 U21.2
$1I45090\$1N2357: R38.1 U21.3
$1I45090\$1N2360: R13.1 U20.8
$1I45090\$1N2365: Q3.1 R38.2
$1I45090\$1N2366: Q2.1 R13.2
$1I45090\$1N2369: C67.2 U20.2
$1I45090\$1N2370: R14.1 U20.3
$1I45090\$1N2372: Q1.1 R14.2
$1I45090\$1N2388: R36.2 U18.4
$1I45090\$1N2393: C71.2 U22.2
$1I45090\$1N2396: R39.1 U22.8
$1I45090\$1N2398: Q6.1 R39.2
$1I45090\$1N2406: C2.2 C89.1 L3.1 U18.5
$1I45090\A_REF: R20.1 R23.1 R29.1 U18.9
$1I45090\AU: R19.1 R20.2 R21.2 U18.6
$1I45090\AV: R22.1 R23.2 R24.2 U18.7
$1I45090\AW: R28.1 R29.2 R30.2 U18.8
$1I45090\BOOT0_ESC: R75.1 U18.31 U35.2
$1I45090\PHASE_U: C67.1 NOREF#7.1 Q1.3 Q2.2 R19.2 U20.4
$1I45090\PHASE_V: C69.1 NOREF#2.1 Q3.3 Q4.2 R22.2 U21.4
$1I45090\PHASE_W: C71.1 NOREF#3.1 Q5.3 Q6.2 R28.2 U22.4
$1I45090\UH: U18.11 U20.5
$1I45090\UL: U18.10 U20.6
$1I45090\USART1_RX: H1.3 U18.20
$1I45090\USART1_TX: H1.2 U18.19
$1I45090\VH: U18.13 U21.5
$1I45090\VL: U18.12 U21.6
$1I45090\WH: U18.15 U22.5
$1I45090\WL: U18.14 U22.6
$1I45112\$1N2344: Q8.1 R18.2
$1I45112\$1N2345: R18.1 U1.3
$1I45112\$1N2351: R25.1 U10.8
$1I45112\$1N2352: Q7.1 R25.2
$1I45112\$1N2355: C24.2 U10.2
$1I45112\$1N2357: R31.1 U10.3
$1I45112\$1N2360: R27.1 U7.8
$1I45112\$1N2365: Q9.1 R31.2
$1I45112\$1N2366: Q10.1 R27.2
$1I45112\$1N2369: C7.2 U7.2
$1I45112\$1N2370: R32.1 U7.3
$1I45112\$1N2372: Q11.1 R32.2
$1I45112\$1N2388: R2.2 U9.4
$1I45112\$1N2393: C32.2 U1.2
$1I45112\$1N2396: R26.1 U1.8
$1I45112\$1N2398: Q12.1 R26.2
$1I45112\$1N2406: C3.1 C8.2 L1.1 U9.5
$1I45112\A_REF: R5.1 R16.1 R17.1 U9.9
$1I45112\AU: R8.1 R15.2 R17.2 U9.6
$1I45112\AV: R7.1 R9.2 R16.2 U9.7
$1I45112\AW: R4.2 R5.2 R6.1 U9.8
$1I45112\BOOT0_ESC: R1.1 U5.2 U9.31
$1I45112\PHASE_U: C7.1 NOREF#10.1 Q10.2 Q11.3 R8.2 U7.4
$1I45112\PHASE_V: C24.1 NOREF#12.1 Q7.2 Q9.3 R7.2 U10.4
$1I45112\PHASE_W: C32.1 NOREF#5.1 Q8.3 Q12.2 R6.2 U1.4
$1I45112\UH: U7.5 U9.11
$1I45112\UL: U7.6 U9.10
$1I45112\USART1_RX: H3.3 U9.20
$1I45112\USART1_TX: H3.2 U9.19
$1I45112\VH: U9.13 U10.5
$1I45112\VL: U9.12 U10.6
$1I45112\WH: U1.5 U9.15
$1I45112\WL: U1.6 U9.14
$1I45134\$1N2344: Q14.1 R50.2
$1I45134\$1N2345: R50.1 U13.3
$1I45134\$1N2351: R51.1 U16.8
$1I45134\$1N2352: Q13.1 R51.2
$1I45134\$1N2355: C41.2 U16.2
$1I45134\$1N2357: R54.1 U16.3
$1I45134\$1N2360: R53.1 U14.8
$1I45134\$1N2365: Q15.1 R54.2
$1I45134\$1N2366: Q16.1 R53.2
$1I45134\$1N2369: C39.2 U14.2
$1I45134\$1N2370: R55.1 U14.3
$1I45134\$1N2372: Q17.1 R55.2
$1I45134\$1N2388: R34.2 U15.4
$1I45134\$1N2393: C54.2 U13.2
$1I45134\$1N2396: R52.1 U13.8
$1I45134\$1N2398: Q18.1 R52.2
$1I45134\$1N2406: C9.2 C11.1 L2.1 U15.5
$1I45134\A_REF: R42.1 R48.1 R49.1 U15.9
$1I45134\AU: R45.1 R47.2 R49.2 U15.6
$1I45134\AV: R44.1 R46.2 R48.2 U15.7
$1I45134\AW: R41.2 R42.2 R43.1 U15.8
$1I45134\BOOT0_ESC: R3.1 U6.2 U15.31
$1I45134\PHASE_U: C39.1 NOREF#8.1 Q16.2 Q17.3 R45.2 U14.4
$1I45134\PHASE_V: C41.1 NOREF.1 Q13.2 Q15.3 R44.2 U16.4
$1I45134\PHASE_W: C54.1 NOREF#6.1 Q14.3 Q18.2 R43.2 U13.4
$1I45134\UH: U14.5 U15.11
$1I45134\UL: U14.6 U15.10
$1I45134\USART1_RX: H4.3 U15.20
$1I45134\USART1_TX: H4.2 U15.19
$1I45134\VH: U15.13 U16.5
$1I45134\VL: U15.12 U16.6
$1I45134\WH: U13.5 U15.15
$1I45134\WL: U13.6 U15.14
$1I45156\$1N2344: Q20.1 R67.2
$1I45156\$1N2345: R67.1 U17.3
$1I45156\$1N2351: R68.1 U24.8
$1I45156\$1N2352: Q19.1 R68.2
$1I45156\$1N2355: C62.2 U24.2
$1I45156\$1N2357: R71.1 U24.3
$1I45156\$1N2360: R70.1 U19.8
$1I45156\$1N2365: Q21.1 R71.2
$1I45156\$1N2366: Q22.1 R70.2
$1I45156\$1N2369: C60.2 U19.2
$1I45156\$1N2370: R72.1 U19.3
$1I45156\$1N2372: Q23.1 R72.2
$1I45156\$1N2388: R57.2 U23.4
$1I45156\$1N2393: C76.2 U17.2
$1I45156\$1N2396: R69.1 U17.8
$1I45156\$1N2398: Q24.1 R69.2
$1I45156\$1N2406: C10.2 C12.1 L5.1 U23.5
$1I45156\A_REF: R59.1 R65.1 R66.1 U23.9
$1I45156\AU: R62.1 R64.2 R66.2 U23.6
$1I45156\AV: R61.1 R63.2 R65.2 U23.7
$1I45156\AW: R58.2 R59.2 R60.1 U23.8
$1I45156\BOOT0_ESC: R10.1 U8.2 U23.31
$1I45156\PHASE_U: C60.1 NOREF#9.1 Q22.2 Q23.3 R62.2 U19.4
$1I45156\PHASE_V: C62.1 NOREF#4.1 Q19.2 Q21.3 R61.2 U24.4
$1I45156\PHASE_W: C76.1 NOREF#11.1 Q20.3 Q24.2 R60.2 U17.4
$1I45156\UH: U19.5 U23.11
$1I45156\UL: U19.6 U23.10
$1I45156\USART1_RX: H5.3 U23.20
$1I45156\USART1_TX: H5.2 U23.19
$1I45156\VH: U23.13 U24.5
$1I45156\VL: U23.12 U24.6
$1I45156\WH: U17.5 U23.15
$1I45156\WL: U17.6 U23.14
BOOT0: R33.1 U12.2 U33.94
BOOT1: R74.1 U33.36
CAM_RST: FPC1.19 R78.2
CAM_XCLK: FPC1.12 U33.67
DCMI_0: FPC1.6 U33.63
DCMI_1: FPC1.4 U33.64
DCMI_2: FPC1.3 U33.65
DCMI_3: FPC1.5 U33.66
DCMI_4: FPC1.7 U33.3
DCMI_5: FPC1.9 U33.92
DCMI_6: FPC1.11 U33.4
DCMI_7: FPC1.13 U33.5
DCMI_HSYNC: FPC1.16 U33.28
DCMI_PXLCLK: C103.2 FPC1.8 U33.30
DCMI_VSYNC: FPC1.18 U33.93
DM: U33.70 USB3.A7 USB3.B7
DP: U33.71 USB3.A6 USB3.B6
E01_CE: U32.2
E01_IRQ: U32.7
GPS_RX_MCU_TX: U27.3 U33.68
GPS_TX_MCU_RX: U27.2 U33.69
I2C1_SCLK: R12.2 U4.1 U33.95
I2C1_SDA: R11.2 U4.16 U33.96
I2C2_SCLK: FPC1.20 R80.2 U33.46
I2C2_SDA: FPC1.22 R79.2 U33.47
IMU_INT: U2.4
MOTOR1: H1.4 U18.30 U33.34
MOTOR2: H3.4 U9.30 U33.35
MOTOR3: H5.4 U23.30 U33.24
MOTOR4: H4.4 U15.30 U33.25
RADIO_RX: H2.4 U33.97
RADIO_TX: H2.3 U33.98
SPI2_CS: U3.2 U33.51
SPI2_MISO: U3.5 U33.53
SPI2_MOSI: U3.3 U33.54
SPI2_SCLK: U3.4 U33.52
SPI3_CS: U2.12 U33.77
SPI3_MISO: U2.1 U33.79
SPI3_MOSI: U2.14 U33.80
SPI3_SCLK: U2.13 U33.78
SPI4_CS: U32.3 U33.41
SPI4_MISO: U32.6 U33.43
SPI4_MOSI: U32.5 U33.44
SPI4_SCLK: U32.4 U33.42
XI_HS: C113.1 U31.3 U33.12
XO_HS: C112.1 U31.1 U33.13
$1N17368: C97.2 C98.2 L6.2 U11.1 U34.1
$1N17546: C95.1 L6.1 U11.5
$1N18305: C50.2 U4.12
$1N18391: C51.1 U4.10
$1N18545: C50.1 U4.8
$1N56559: C95.2 U11.6
$1N79325: L7.2 L8.1 U27.11
$1N79329: L7.1 U27.14
$1N81168: FPC1.17 R77.2
$1N85586: R81.1 USB3.B5
$1N85625: R82.2 USB3.A5
$1N96765: R76.2 U33.14
$1N102666: C115.2 U33.73
$1N105569: C116.2 U33.48

Pads without a net: FPC1 1 2 24; U2 2 3 10; U4 3 5 6 7 14 15; U9 2 3 18 21 22 23 24 25 26 27 28 29; U15 2 3 18 21 22 23 24 25 26 27 28 29; U18 2 3 18 21 22 23 24 25 26 27 28 29; U23 2 3 18 21 22 23 24 25 26 27 28 29; U27 4 5 7 9 13 15 16 17 18; U33 1 2 7 8 9 15 16 17 18 20 22 23 29 31 32 33 37 38 39 40 45 55 56 57 58 59 60 61 62 72 76 81 82 83 84 85 86 87 88 89 90 91; USB3 A8 B8

## Via types
v1: diameter 0.61, hole 0.305, Top Layer to Bottom Layer, 568 vias

## Routing (per net, layer and track width the routed paths; a pad name or vN(x,y) marks a point on that pad's centre or on a via; arc(x,y) is an arc through that point)
1.2V: length 3.6
  Top Layer w0.508: v1(41.15,45.95) 41.15,45.16 C108.2 41.29,44.88 U29.2
  Bottom Layer w0.254: v1(41.15,45.95) 41.04,46.06 FPC1.15
2.8V: length 3.4
  Top Layer w0.508: U30.2 37.86,44.99 C109.2 37.93,45.91 v1(37.97,45.95)
  Bottom Layer w0.254: FPC1.21 38.04,46.02 v1(37.97,45.95)
3V3: length 228.3
  Top Layer w0.254: v1(61.96,13.53) 62.94,13.53 L4.1 ; C52.1 48.33,28.77 U4.4 ; C52.1 48.2,27.77 U4.2 ; C52.1 49.4,27.7 v1(49.4,27.33) ; v1(65.71,19.22) 66.34,19.85 U33.27 ; C106.1 48.72,35.52 U2.8 ; v1(44.78,34.54) 45.52,33.8 C27.2 45.86,34.1 U2.5 ; 65.08,37.63 65.08,39.07 C28.1 64.96,39.38 v1(65.79,40.21) 66.74,39.26 C29.1 66.38,38.83 U3.8 ; v1(53.21,36.27) 53.21,36.02 53.38,35.86 C77.2 53.56,34.37 U33.75 ; U4.13 45.35,25.55 C53.1 45.15,25.92 v1(44.71,26.36) ; v1(56.64,16.33) 56.06,16.91 U33.6 ; v1(67.12,32.01) 67.12,31.36 U33.50 ; U33.100 52.01,18.84 v1(51.88,18.71) 50.17,18.71 C81.2 ; R79.1 50.27,38.35 48.72,38.35 v1(48.26,38.81) 48.13,38.94 48.13,45.57 46.96,46.74 43.09,46.74 41.54,48.29 v1(41.53,48.29) 39.57,48.29 v1(37.97,49.89) 34.39,49.89 24.33,39.83 24.33,37.92 22.2,35.79 21.23,35.79 20.6,36.42 19.86,36.42 19.38,35.94 v1(19.38,34.88) ; U33.11 58.56,16.31 C80.2 v1(58.46,15.47) 58.46,14.77 58.67,14.55 R76.1
  Top Layer w0.508: v1(40.39,24.84) 40.42,24.88 40.42,25.89 ; U5.1 19.16,39.01 17.2,40.97 v1(14.15,40.97) 13.27,40.09 R2.1 10.67,40.04 9.22,40.04 C22.2 7.71,38.53 L1.2 5.64,37.92 v1(5.64,37.67) 5.64,34.47 U8.1 5.86,33.54 7.82,31.58 v1(10.87,31.58) 11.75,32.46 R57.1 14.35,32.51 15.8,32.51 C61.2 17.31,34.02 L5.2 19.38,34.63 v1(19.38,34.88) ; U6.1 73.55,33.53 75.51,31.57 v1(78.56,31.57) 79.44,32.45 R34.1 82.04,32.5 83.49,32.5 C40.2 85,34.01 L2.2 87.07,34.62 v1(87.07,34.87) 87.07,38.08 U35.1 86.85,39.01 84.89,40.97 v1(81.84,40.97) 80.96,40.09 R36.1 78.36,40.04 76.91,40.04 C66.2 75.4,38.53 L3.2 73.33,37.92 v1(73.33,37.67) 70.03,37.67 v1(69.88,37.52)
  Top Layer w0.635: C81.2 50.04,17.16 C94.1 49.08,15.82 v1(48.51,15.82) 47.12,14.43 U12.1 ; v1(50.24,34.57) 50.29,34.62 C25.2 50.19,35.47 C106.1
  Bottom Layer w0.254: v1(67.12,32.01) 67.14,31.99 C78.2 ; R78.1 38.91,49.89 v1(37.97,49.89) ; C105.2 v1(41.53,48.29) 41.53,47.25 FPC1.14 ; v1(65.71,19.22) 66.55,20.05 C79.2
  Bottom Layer w0.508: 75.69,38.8 74.47,38.8 v1(73.33,37.67) ; v1(78.56,31.57) 77.47,30.48 77.47,28.68 76.93,28.14 U15.17 74.94,28.14 C43.1 ; v1(81.84,40.97) 82.93,42.06 82.93,43.87 83.47,44.4 U18.17 85.47,44.4 C63.1 ; v1(10.87,31.58) 9.78,30.49 9.78,28.68 9.24,28.14 U23.17 7.24,28.14 C75.1 ; U23.1 18.24,33.74 v1(19.38,34.88) ; C31.1 17.78,44.4 U9.17 15.78,44.4 15.24,43.87 15.24,42.06 v1(14.15,40.97) ; U15.1 85.93,33.74 v1(87.07,34.87) ; U9.1 6.78,38.8 v1(5.64,37.67) ; v1(40.39,24.84) 40.55,25.01 C114.1
  Bottom Layer w0.635: R11.1 47.87,21.8 v1(47.37,22.3) ; R12.1 50.03,26.12 49.4,26.75 v1(49.4,27.33) ; U27.6 58.97,27.89 58.29,27.21 v1(58.29,25.86) 57.85,25.86 56.77,26.94 U27.8
  Bottom Layer w1.27: C99.1 47.19,18.45 v1(46.82,18.45)
  Bottom Layer w1.524: 47.58,14.99 48.12,15.54 C99.1
5V_USB: length 15.6
  Top Layer w0.254: 57.81,9.7 57.81,9.18 57.32,8.69 55.89,8.69 54.01,6.81 52.93,6.81 ; 57.81,9.7 57.53,9.98 57.53,10.62 57.53,10.62 USB3.A4 ; 57.81,9.7 57.81,10.61 USB3.B9 57.83,10.62 57.83,11.61 58.99,12.78 60.86,12.78 62.25,11.38 62.25,10.69 USB3.B4
7.4V_BATTERY: length 226
  Top Layer w0.762: U16.1 76.97,20.34 v1(76.53,20.78) ; U20.1 75.68,52.21 v1(76.11,51.78) ; v1(68.8,20.76) 69.22,20.34 U13.1 ; U10.1 15.74,52.21 v1(16.18,51.76) ; v1(83.87,51.76) 83.43,52.21 U21.1 ; U24.1 9.28,20.34 v1(8.84,20.78) ; v1(23.91,51.78) 23.49,52.21 U1.1 ; U19.1 17.03,20.34 v1(16.6,20.77) ; v1(91.6,51.78) 91.18,52.21 U22.1 ; v1(84.29,20.76) 84.72,20.34 U14.1 ; v1(8.42,51.78) 7.99,52.21 U7.1 ; U17.1 1.53,20.34 v1(1.11,20.77)
  Power w0.762: v1(76.38,65.99) v1(76.38,64.17) 74.96,62.75 74.96,52.93 v1(76.11,51.78) v1(76.11,50.9) ; v1(84.13,65.99) v1(84.13,64.18) 82.78,62.83 82.78,53.78 83.87,52.69 v1(83.87,51.76) v1(83.87,50.88) ; v1(8.69,65.99) v1(8.69,64.17) 7.01,62.49 7.01,53.19 v1(8.42,51.78) v1(8.42,50.9) ; v1(8.84,21.67) v1(8.84,20.78) 8.58,20.53 v1(8.58,8.37) v1(8.58,6.56) ; v1(16.6,21.64) v1(16.6,20.77) 16.33,20.5 v1(16.33,8.38) v1(16.33,6.56) ; v1(91.6,50.9) v1(91.6,51.78) 91.6,52.7 90.53,53.78 90.53,62.83 v1(91.87,64.18) v1(91.87,65.99) ; v1(16.18,50.88) v1(16.18,51.76) 14.76,53.19 14.76,62.5 v1(16.43,64.18) v1(16.43,65.99) ; v1(68.53,6.55) v1(68.53,8.37) 68.53,20.49 v1(68.8,20.76) v1(68.8,21.64) ; v1(0.84,6.56) v1(0.84,8.37) 0.84,20.5 v1(1.11,20.77) v1(1.11,21.64) ; v1(76.28,6.55) v1(76.28,8.37) 76.28,20.52 v1(76.53,20.78) v1(76.53,21.67) ; v1(23.91,50.9) v1(23.91,51.78) 22.53,53.16 22.53,62.53 v1(24.18,64.18) v1(24.18,65.99) ; v1(84.29,21.64) v1(84.29,20.76) 84.02,20.49 v1(84.02,8.37) v1(84.02,6.55)
  Bottom Layer w0.635: 31.3,10.91 31.3,11.69 32.09,11.69 32.09,10.91 ; U11.2 U11.3
  Bottom Layer w0.762: v1(91.6,50.9) 91.13,50.43 C70.2 ; C36.2 69.27,22.11 v1(68.8,21.64) ; C57.2 1.58,22.11 v1(1.11,21.64) ; C4.2 23.44,50.43 v1(23.91,50.9) ; C37.2 84.76,22.11 v1(84.29,21.64) ; v1(16.6,21.64) 17.07,22.11 C58.2 ; v1(8.42,50.9) 7.95,50.43 C5.2 ; v1(16.18,50.88) 15.74,50.43 C6.2 ; C59.2 9.28,22.11 v1(8.84,21.67) ; C55.2 75.64,50.43 v1(76.11,50.9) ; C68.2 83.43,50.43 v1(83.87,50.88) ; C38.2 76.97,22.11 v1(76.53,21.67)
  Bottom Layer w1.27: C96.2 32.8,14.17 31.65,15.32 v1(31.65,14.61) v1(31.65,13.89) v1(31.65,13.21) v1(31.65,12.45) U11.3
  vias: v1(16.33,4.58) v1(16.33,2.5) v1(24.94,6.6) v1(25.04,14.4) v1(25.04,9.14) v1(25.37,19.71) v1(25.51,1.97) v1(25.79,4.9) v1(25.91,16.71) v1(26.32,14.37) v1(26.8,18.24) v1(27.18,19.89) v1(27.3,16.33) v1(27.51,21.44) v1(27.56,15.06) v1(27.53,4.93) v1(27.69,17.22) v1(27.61,2.69) v1(27.93,18.55) v1(27.94,13.79) v1(28.83,13.28) v1(29.46,19) v1(29.46,13.92) v1(29.45,1.71) v1(29.97,13.03) v1(30.07,20.88) v1(30.99,19) v1(32.39,18.36) v1(32.61,19.81) v1(33.02,15.95) v1(33.02,3.63) v1(33.27,17.98) v1(33.27,16.84) v1(35.23,1.42) v1(36.2,3.53) v1(38.35,1.32) v1(39.62,3.83) v1(42.09,1.57) v1(43.98,3.33) v1(45.85,1.6) v1(47.47,3.12) v1(49.1,1.6) v1(51.03,2.56) v1(58.73,5.74) v1(60.07,7.13) v1(62.05,5.16) v1(63.58,64.11) v1(63.58,62.41) v1(63.58,60.71) v1(63.58,59) v1(63.58,57.3) v1(63.58,55.6) v1(63.58,53.9) v1(63.58,52.2) v1(65.28,65.81) v1(65.28,64.11) v1(65.28,62.41) v1(65.28,60.71) v1(65.28,59) v1(65.28,57.3) v1(65.28,55.6) v1(65.28,53.9) v1(65.28,52.2) v1(65.56,12.7) v1(66.4,11.66) v1(66.32,9.96) v1(66.37,7.95) v1(66.47,6.38) v1(66.78,14.4) v1(66.98,67.51) v1(66.98,65.81) v1(66.98,64.11) v1(66.98,62.41) v1(66.98,60.71) v1(66.98,59) v1(66.98,57.3) v1(66.98,55.6) v1(66.98,53.9) v1(66.98,52.2) v1(67.23,12.98) v1(68.53,5.45) v1(68.53,3.71) v1(68.53,2.19) v1(76.28,5.1) v1(76.28,3.9) v1(76.28,2.47) v1(76.28,1.13) v1(76.38,71.26) v1(76.38,69.5) v1(76.38,67.67) v1(84.02,4.49) v1(84.02,2.76) v1(84.02,1.11) v1(84.13,71.16) v1(84.13,69.43) v1(84.13,67.6) v1(91.87,71.37) v1(91.87,69.68) v1(91.87,68.09)
+5V: length 51.3
  Top Layer w0.508: U30.3 38.81,40.19 C110.2 ; U29.3 42.24,40.32 C107.2
  Top Layer w0.635: 40.18,20.95 H2.2 40.13,22.02 38.21,23.94 38.21,35.21 38.63,35.63 38.63,39.04 38.9,39.31 ; 38.9,39.31 C110.2 ; 38.9,39.31 39.5,38.71 41.66,38.71 42.33,39.38 C107.2
  Power w0.635: 48.13,6.68 45.34,9.47 45.34,14.3 40.13,19.51 H2.2
  Bottom Layer w1.016: C1.2 49.08,6.68 U34.2 48.64,8.91 U25.1
GND: length 265.8
  Top Layer w0.254: U2.6 46.36,34.41 47.79,32.97 v1(48.01,32.97) ; U2.7 46.96,35.15 C27.1 ; v1(54.27,35.31) 54.22,35.26 C77.1 54.06,34.4 U33.74 ; C93.1 62.95,14.95 62.5,15.4 62.5,15.63 C92.1 62.56,16.47 U33.19 ; U4.11 44.74,27.67 44.5,27.67 44.33,27.51 44.33,27.26 v1(44.05,26.97) 43.75,26.68 C53.2 ; U33.49 68.29,30.85 v1(68.45,30.69) ; R33.2 49.91,20.52 50.58,19.85 ; v1(65.75,38.38) 65.73,38.35 U3.7 ; 50.58,19.85 v1(50.72,19.85) U33.99 ; 50.58,19.85 50.47,19.85 C81.1 ; C80.1 57.62,16.41 58.06,16.85 U33.10 58.07,17.81 v1(58.07,19.1) ; C28.2 63.56,40.26 v1(63.58,40.28) ; C51.2 43.74,29.86 v1(44.35,29.25) U4.9 ; U2.11 50.24,37.02 C25.1 49.63,36.31 C106.2 48.48,36.02 U2.9 ; v1(66.42,18.62) 66.42,18.66 U33.26 ; U3.1 66.84,36.18 v1(67.69,37.03) 68.14,37.48 C29.2
  Top Layer w0.508: v1(86.94,17.86) 86.79,17.71 Q16.3 ; v1(19.63,33.1) 19.63,31.87 C12.2 C10.1 ; 38.77,45.06 39.76,44.07 U30.1 ; 39.76,43.75 v1(39.76,42.78) 39.76,40.13 C110.1 ; v1(86.05,35.13) 85.86,35.32 C40.1 84.72,35.51 R3.2 ; v1(3.89,24.08) 3.25,24.72 U17.7 ; 82.51,54.84 81.35,54.84 v1(81.2,54.69) ; v1(13.51,54.69) 13.66,54.84 14.81,54.84 ; C108.1 43.19,43.96 v1(43.19,42.73) 43.19,40.26 C107.1 ; v1(21.13,48.46) 21.77,47.83 U1.7 ; R1.2 7.99,37.03 C22.1 6.85,37.22 v1(6.66,37.41) ; v1(73.46,48.46) 73.96,47.96 U20.7 ; v1(79.2,23.95) 78.69,24.46 U16.7 ; U14.7 86.44,24.59 v1(86.94,24.08) ; U21.7 81.71,48.08 v1(81.2,48.59) ; v1(5.39,39.45) 5.39,40.68 5.35,40.72 5.35,41.99 ; Q24.3 3.61,17.71 v1(3.76,17.86) ; U24.7 11,24.46 v1(11.51,23.96) ; v1(21.26,54.69) 21.41,54.84 22.56,54.84 ; v1(11.51,17.86) 11.36,17.71 Q19.3 ; v1(5.77,54.69) 5.92,54.84 7.07,54.84 ; v1(18.36,35.13) 18.17,35.32 C61.1 17.03,35.51 R10.2 ; v1(19.25,24.08) 18.75,24.59 U19.7 ; R75.2 75.68,37.03 C66.1 74.54,37.22 v1(74.35,37.41) ; v1(87.33,33.1) 87.33,31.86 87.36,31.83 87.36,30.56 ; U7.7 6.27,47.96 v1(5.77,48.46) ; v1(13.51,48.59) 14.02,48.08 U10.7 ; v1(73.08,39.45) 73.08,40.68 C89.2 C2.1 ; U13.7 70.94,24.71 v1(71.58,24.08) ; Q22.3 19.1,17.71 v1(19.25,17.86) ; 90.25,54.84 89.1,54.84 v1(88.95,54.69) ; v1(88.82,48.46) 89.46,47.83 89.46,47.07 ; v1(71.45,17.86) 71.3,17.71 Q18.3 ; v1(79.2,17.86) 79.05,17.71 Q13.3 ; v1(73.46,54.69) 73.61,54.84 74.76,54.84
  Top Layer w0.635: v1(49.66,31.32) 48.77,30.43 C52.2 ; v1(52.32,15.44) 51.63,16.14 C94.2 ; U32.9 27.63,36.7 26.82,35.89 23.22,35.89 22.38,35.05 20.85,35.05 v1(20.14,35.76) ; C115.1 56.96,36.71 v1(56.76,36.91) ; v1(39.62,35.76) 40.42,34.96 U32.8
  Top Layer w0.889: USB3.A12 63.74,10.62 USB3.2 ; USB3.1 56.4,10.62 USB3.A1
  Top Layer w1.016: U32.10 22.24,29.57 v1(20.85,29.57) ; 37.59,20.9 CN1.1
  Bottom Layer w0.254: FPC1.10 43.54,48.76 C103.1 42.89,49.16 v1(42.25,49.8) C105.1 41.52,49.81 v1(40.82,49.81) R77.1 ; C112.2 59.73,22.22 58.85,21.35 C113.2 ; R74.2 66.83,25.88 v1(65.76,25.88) ; U31.4 v1(61.14,24.33) ; v1(66.42,18.62) 66.59,18.62 C79.1 ; v1(36.78,48.36) 37.04,48.1 FPC1.23 ; C116.1 67.56,30.62 68.38,30.62 v1(68.45,30.69) 67.98,31.15 C78.1 ; U27.1 64.47,29.84 v1(64.14,30.17)
  Bottom Layer w0.508: v1(5.77,54.69) 4.63,54.69 R15.1 ; C36.1 70.48,24.08 v1(71.58,24.08) ; C5.1 6.74,48.46 v1(5.77,48.46) ; C43.2 76.09,26.3 v1(76.4,25.98) 77.11,26.69 U15.16 ; R64.1 20.39,17.86 v1(19.25,17.86) ; C31.2 16.62,46.24 v1(16.31,46.56) 15.6,45.85 U9.16 ; v1(3.76,17.86) 4.89,17.86 R58.1 ; R24.1 80.07,54.69 v1(81.2,54.69) ; v1(11.51,17.86) 12.64,17.86 R63.1 ; v1(19.25,24.08) 18.28,24.08 C58.1 ; R47.1 88.08,17.86 v1(86.94,17.86) ; C57.1 2.79,24.08 v1(3.89,24.08) ; C63.2 84.31,46.24 v1(84,46.56) 83.29,45.85 U18.16 ; v1(21.13,48.46) 22.23,48.46 C4.1 ; C70.1 89.92,48.46 v1(88.82,48.46) ; R41.1 72.58,17.86 v1(71.45,17.86) ; C68.1 82.3,48.59 v1(81.2,48.59) ; v1(79.2,17.86) 80.33,17.86 R46.1 ; C75.2 8.4,26.3 v1(8.71,25.99) 9.42,26.7 U23.16 ; v1(13.51,54.69) 12.38,54.69 R9.1 ; C96.1 35.45,14.11 v1(35.45,12.43) 34.88,11.86 U11.4 ; U15.32 86,35.18 v1(86.05,35.13) ; 15.58,35.18 18.31,35.18 v1(18.36,35.13) ; v1(6.66,37.41) 6.71,37.36 U9.32 ; R4.1 20.13,54.69 v1(21.26,54.69) ; C55.1 74.43,48.46 v1(73.46,48.46) ; 77.13,37.36 74.4,37.36 v1(74.35,37.41) ; v1(13.51,48.59) 14.61,48.59 C6.1 ; v1(39.27,24.61) 39.67,25.02 39.67,25.14 39.71,25.17 C114.2 ; v1(79.2,23.95) 78.1,23.95 C38.1 ; v1(11.51,23.96) 10.41,23.96 C59.1 ; v1(86.94,24.08) 85.97,24.08 C37.1 ; R21.1 72.32,54.69 v1(73.46,54.69) ; v1(88.95,54.69) 87.82,54.69 R30.1
  Bottom Layer w0.635: U27.12 57.87,37.5 57.28,36.91 v1(56.76,36.91) 56.13,36.91 55.67,37.37 U27.10 ; C100.1 54.85,27.33 v1(54.85,28.08) ; v1(51.56,9.47) 51.75,9.28 C1.1
  Bottom Layer w0.762: 30.05,8.09 30.05,6.33
  Bottom Layer w1.016: 63.63,7.96 64.39,8.72 USB3.2 ; v1(50.55,47.22) 49.73,46.4 FPC1.26 ; USB3.1 55.75,9.25 R82.1 ; v1(34.04,47.09) v1(34.6,46.53) 34.85,46.28 FPC1.25
  Bottom Layer w1.27: CN1.1 37.59,16.38 C96.1
  Bottom Layer w1.524: C99.2 52.32,16.38 v1(52.32,15.44) 52.32,13.2 U25.4 v1(50.43,12.27) U25.2
  vias: v1(3.56,17.15) v1(3.58,16.41) v1(4.27,16.74) v1(4.42,18.32) v1(4.51,17.4) v1(5.08,55.14) v1(5.92,55.55) v1(8.18,54.77) v1(8.26,55.67) v1(8.97,54.86) v1(8.99,53.31) v1(9.03,56.16) v1(11.33,17.07) v1(11.81,16.46) v1(12.17,17.25) v1(12.27,18.34) v1(12.83,55.14) v1(13.66,55.55) v1(15.93,54.77) v1(16.01,55.67) v1(16.77,56.16) v1(16.71,54.86) v1(16.74,53.31) v1(19.05,17.15) v1(19.15,16.44) v1(19.79,16.84) v1(19.99,18.37) v1(20.06,17.48) v1(20.57,55.14) v1(21.41,55.55) v1(23.67,54.77) v1(23.76,55.67) v1(24.46,54.86) v1(24.49,53.31) v1(24.52,56.16) v1(30.05,7.32) v1(35.13,17.6) v1(35.15,15.82) v1(35.84,18.54) v1(36.75,12.95) v1(37.8,13.66) v1(39.37,13) v1(39.5,14.55) v1(39.79,18.37) v1(40.51,15.7) v1(40.77,17.09) v1(41.02,14.45) v1(41.35,12.6) v1(41.91,15.7) v1(42.16,18.87) v1(42.8,12.04) v1(42.9,13.66) v1(43.18,17.98) v1(44.07,17.09) v1(44.02,12.93) v1(45.08,16.2) v1(49.28,37.03) v1(49.93,46.6) v1(59.01,21.5) v1(62.54,15.44) v1(71.25,17.14) v1(71.27,16.41) v1(71.96,16.74) v1(72.11,18.31) v1(72.2,17.4) v1(72.77,55.14) v1(73.61,55.55) v1(75.87,54.77) v1(75.95,55.67) v1(76.66,54.86) v1(76.68,53.31) v1(76.72,56.16) v1(79.02,17.07) v1(79.5,16.46) v1(79.86,17.25) v1(79.96,18.34) v1(80.52,55.14) v1(81.35,55.55) v1(83.7,55.67) v1(83.62,54.77) v1(84.4,54.86) v1(84.47,56.16) v1(84.43,53.31) v1(86.74,17.14) v1(86.84,16.43) v1(87.48,16.84) v1(87.68,18.36) v1(87.76,17.47) v1(88.27,55.14) v1(89.1,55.55) v1(91.52,55.62) v1(91.59,54.74) v1(91.8,53.9) v1(92.01,56.26)
VDDA: length 4.4
  Top Layer w0.254: L4.2 C93.2 C92.2 63.79,16.44 63.56,16.67 U33.21
$1I45090\$1N2344: length 2.2
  Bottom Layer w0.508: Q5.1 R40.2
$1I45090\$1N2345: length 4
  Top Layer w0.508: U22.3 88.19,53.67 v1(88.44,53.92)
  Bottom Layer w0.508: R40.1 89.34,53.92 v1(88.44,53.92)
$1I45090\$1N2351: length 7.5
  Top Layer w0.508: R37.1 78.8,50.63 80.08,49.35 81.84,49.35 82.98,48.21 U21.8
$1I45090\$1N2352: length 2.8
  Top Layer w0.508: 77.93,54.84 77.67,54.57 R37.2
$1I45090\$1N2355: length 2.6
  Top Layer w0.508: U21.2 81.71,51.49 v1(81.09,50.88)
  Bottom Layer w0.508: v1(81.09,50.88) 81.09,51.83 C69.2
$1I45090\$1N2357: length 4
  Top Layer w0.508: v1(80.7,53.92) 80.44,53.67 U21.3
  Bottom Layer w0.508: v1(80.7,53.92) 81.59,53.92 R38.1
$1I45090\$1N2360: length 7.2
  Top Layer w0.508: U20.8 75.23,47.85 73.86,49.22 72.46,49.22 71.05,50.63 R13.1
$1I45090\$1N2365: length 2.2
  Bottom Layer w0.508: Q3.1 R38.2
$1I45090\$1N2366: length 2.8
  Top Layer w0.508: R13.2 69.92,54.57 70.19,54.84
$1I45090\$1N2369: length 2.6
  Top Layer w0.508: v1(73.35,50.88) 73.96,51.49 U20.2
  Bottom Layer w0.508: v1(73.35,50.88) 73.35,51.83 C67.2
$1I45090\$1N2370: length 4
  Top Layer w0.508: v1(72.95,53.92) 72.69,53.67 U20.3
  Bottom Layer w0.508: R14.1 73.85,53.92 v1(72.95,53.92)
$1I45090\$1N2372: length 2.2
  Bottom Layer w0.508: Q1.1 R14.2
$1I45090\$1N2388: length 3
  Top Layer w0.508: R36.2 77.73,41.6 v1(77.14,41.01)
  Bottom Layer w0.508: v1(77.14,41.01) 76.94,41.2 75.69,41.2
$1I45090\$1N2393: length 2.6
  Top Layer w0.508: v1(88.84,50.88) 89.46,51.49 89.46,52.21
  Bottom Layer w0.508: C71.2 88.84,51.83 v1(88.84,50.88)
$1I45090\$1N2396: length 7.5
  Top Layer w0.508: R39.1 86.55,50.63 87.95,49.22 89.84,49.22 90.73,48.34 U22.8
$1I45090\$1N2398: length 2.8
  Top Layer w0.508: R39.2 85.41,54.57 85.68,54.84
$1I45090\$1N2406: length 7.7
  Top Layer w0.508: L3.1 73.94,40.65 C89.1 C2.2 76.76,41.99 v1(77.14,42.37)
  Bottom Layer w0.508: 75.69,42 76.78,42 v1(77.14,42.37)
$1I45090\A_REF: length 30.7
  Bottom Layer w0.508: R29.1 83.14,54.06 82.29,53.21 78.77,53.21 R23.1 75.39,54.06 74.55,53.21 71.02,53.21 R20.1 70.17,48.57 71.93,46.81 76.63,46.81 77.13,46.3 77.13,45.85
$1I45090\AU: length 20.9
  Power w0.508: v1(70.66,56.59) 70.66,46.3 v1(73.71,43.26)
  Bottom Layer w0.508: v1(73.71,43.26) 74.16,42.8 75.69,42.8 ; R20.2 R21.2 R19.1 71.06,56.98 70.94,56.86 70.94,56.86 v1(70.66,56.59)
$1I45090\AV: length 20.1
  Power w0.508: v1(74.22,44.02) 74.22,44.65 77.67,48.1 77.67,53.4 78.41,54.14 v1(78.41,56.59)
  Bottom Layer w0.508: R23.2 R24.2 R22.1 78.8,56.98 78.69,56.86 78.68,56.86 v1(78.41,56.59) ; v1(74.22,44.02) 74.63,43.6 75.69,43.6
$1I45090\AW: length 23
  Power w0.508: v1(86.16,56.59) 86.16,54.14 85.41,53.4 85.41,51.28 77.77,43.65 v1(77.77,43.64)
  Bottom Layer w0.508: 75.69,44.4 76.51,44.4 77.23,43.69 77.72,43.69 v1(77.77,43.64) ; v1(86.16,56.59) 86.43,56.86 86.43,56.86 86.55,56.98 R28.1 R30.2 R29.2
$1I45090\BOOT0_ESC: length 4.7
  Top Layer w0.508: v1(77.39,39.32) 77.85,38.87 U35.2 77.95,38.2 77.95,37.03
  Bottom Layer w0.508: v1(77.39,39.32) 77.93,38.78 U18.31
$1I45090\PHASE_U: length 9.9
  Top Layer w0.508: v1(71.95,50.88) 71.42,51.4 U20.4 71.42,53.14 71.68,53.4 71.68,55.56 72.47,56.35 72.47,57 v1(72.82,57.35)
  Bottom Layer w0.508: C67.1 71.89,50.94 v1(71.95,50.88) ; Q1.3 71.66,58.52 R19.2
  vias: v1(72.7,58.14) v1(73.56,58.11) v1(73.58,57.23)
$1I45090\PHASE_V: length 9.9
  Top Layer w0.508: v1(79.7,50.88) 79.17,51.4 U21.4 79.17,53.14 79.42,53.4 79.42,55.56 80.22,56.35 80.22,57 v1(80.57,57.35)
  Bottom Layer w0.508: R22.2 79.41,58.52 Q3.3 ; C69.1 79.63,50.94 v1(79.7,50.88)
  vias: v1(80.44,58.14) v1(81.31,58.11) v1(81.33,57.23)
$1I45090\PHASE_W: length 9.9
  Top Layer w0.508: v1(87.44,50.88) 86.92,51.4 U22.4 86.92,53.14 87.17,53.4 87.17,55.56 87.97,56.35 87.97,57 v1(88.32,57.35)
  Bottom Layer w0.508: Q5.3 87.16,58.52 R28.2 ; C71.1 87.38,50.94 v1(87.44,50.88)
  vias: v1(88.19,58.14) v1(89.05,58.11) v1(89.08,57.23)
$1I45090\UH: length 10.1
  Top Layer w0.508: U20.5 71.42,48.08 v1(71.93,48.59)
  Bottom Layer w0.508: U18.11 78.73,46.56 77.59,47.7 72.82,47.7 v1(71.93,48.59)
$1I45090\UL: length 8
  Top Layer w0.508: v1(77.52,44.53) 76.25,44.53 75.36,45.41 73.33,45.41 72.69,46.05 U20.6
  Bottom Layer w0.508: U18.10 77.93,44.94 v1(77.52,44.53)
$1I45090\USART1_RX: length 6.3
  Bottom Layer w0.508: H1.3 87.03,42 U18.20
$1I45090\USART1_TX: length 5.6
  Bottom Layer w0.508: H1.2 88.77,42.8 U18.19
$1I45090\VH: length 4.7
  Top Layer w0.508: v1(79.68,48.59) 79.17,48.08 U21.5
  Bottom Layer w0.508: U18.13 80.33,47.94 v1(79.68,48.59)
$1I45090\VL: length 4.3
  Top Layer w0.508: U21.6 80.44,45.23 v1(79.68,44.47)
  Bottom Layer w0.508: U18.12 79.53,44.62 v1(79.68,44.47)
$1I45090\WH: length 8.6
  Top Layer w0.508: U22.5 86.92,48.72 v1(86.67,48.97)
  Bottom Layer w0.508: v1(86.67,48.97) 85.01,47.32 82.47,47.32 81.93,46.78 U18.15
$1I45090\WL: length 9.9
  Top Layer w0.508: U22.6 88.19,46.3 86.92,45.03 82.98,45.03 82.35,44.4 v1(81.46,44.4)
  Bottom Layer w0.508: v1(81.46,44.4) 81.13,44.72 81.13,45.85
$1I45112\$1N2344: length 2.2
  Bottom Layer w0.508: Q8.1 R18.2
$1I45112\$1N2345: length 4
  Top Layer w0.508: v1(20.75,53.92) 20.5,53.67 U1.3
  Bottom Layer w0.508: v1(20.75,53.92) 21.65,53.92 R18.1
$1I45112\$1N2351: length 7.5
  Top Layer w0.508: R25.1 11.11,50.63 12.39,49.35 14.15,49.35 15.29,48.21 U10.8
$1I45112\$1N2352: length 2.8
  Top Layer w0.508: R25.2 9.97,54.57 10.24,54.84
$1I45112\$1N2355: length 2.6
  Top Layer w0.508: U10.2 14.02,51.49 v1(13.4,50.88)
  Bottom Layer w0.508: v1(13.4,50.88) 13.4,51.83 C24.2
$1I45112\$1N2357: length 4
  Top Layer w0.508: U10.3 12.75,53.67 v1(13.01,53.92)
  Bottom Layer w0.508: v1(13.01,53.92) 13.9,53.92 R31.1
$1I45112\$1N2360: length 7.2
  Top Layer w0.508: R27.1 3.36,50.63 4.77,49.22 6.16,49.22 7.54,47.85 U7.8
$1I45112\$1N2365: length 2.2
  Bottom Layer w0.508: Q9.1 R31.2
$1I45112\$1N2366: length 2.8
  Top Layer w0.508: R27.2 2.23,54.57 2.5,54.84
$1I45112\$1N2369: length 2.6
  Top Layer w0.508: v1(5.66,50.88) 6.27,51.49 U7.2
  Bottom Layer w0.508: v1(5.66,50.88) 5.66,51.83 C7.2
$1I45112\$1N2370: length 4
  Top Layer w0.508: U7.3 5,53.67 v1(5.26,53.92)
  Bottom Layer w0.508: v1(5.26,53.92) 6.16,53.92 R32.1
$1I45112\$1N2372: length 2.2
  Bottom Layer w0.508: Q11.1 R32.2
$1I45112\$1N2388: length 3
  Top Layer w0.508: R2.2 10.04,41.6 v1(9.45,41.01)
  Bottom Layer w0.508: v1(9.45,41.01) 9.25,41.2 U9.4
$1I45112\$1N2393: length 2.6
  Top Layer w0.508: v1(21.15,50.88) 21.77,51.49 U1.2
  Bottom Layer w0.508: v1(21.15,50.88) 21.15,51.83 C32.2
$1I45112\$1N2396: length 7.5
  Top Layer w0.508: R26.1 18.86,50.63 20.26,49.22 22.15,49.22 23.04,48.34 U1.8
$1I45112\$1N2398: length 2.8
  Top Layer w0.508: 17.99,54.84 17.72,54.57 R26.2
$1I45112\$1N2406: length 7.7
  Top Layer w0.508: L1.1 6.25,40.65 C3.1 C8.2 9.07,41.99 v1(9.45,42.37)
  Bottom Layer w0.508: U9.5 9.09,42 v1(9.45,42.37)
$1I45112\A_REF: length 30.7
  Bottom Layer w0.508: R5.1 15.45,54.06 14.6,53.21 11.08,53.21 R16.1 7.7,54.06 6.85,53.21 3.33,53.21 R17.1 2.48,48.57 4.24,46.81 8.93,46.81 9.44,46.3 U9.9
$1I45112\AU: length 20.9
  Power w0.508: v1(6.02,43.26) 2.97,46.3 v1(2.97,56.59)
  Bottom Layer w0.508: v1(2.97,56.59) 3.24,56.86 3.25,56.86 3.37,56.98 R8.1 R15.2 R17.2 ; U9.6 6.47,42.8 v1(6.02,43.26)
$1I45112\AV: length 20.1
  Power w0.508: v1(6.53,44.02) 6.53,44.65 9.97,48.1 9.97,53.4 10.72,54.14 v1(10.72,56.59)
  Bottom Layer w0.508: v1(10.72,56.59) 10.99,56.86 11,56.86 11.11,56.98 R7.1 R9.2 R16.2 ; U9.7 6.94,43.6 v1(6.53,44.02)
$1I45112\AW: length 23
  Power w0.508: v1(18.47,56.59) 18.47,54.14 17.72,53.4 17.72,51.28 10.08,43.65 v1(10.08,43.64)
  Bottom Layer w0.508: v1(18.47,56.59) 18.74,56.86 18.74,56.86 18.86,56.98 R6.1 R4.2 R5.2 ; v1(10.08,43.64) 10.03,43.69 9.54,43.69 8.82,44.4 U9.8
$1I45112\BOOT0_ESC: length 4.7
  Top Layer w0.508: R1.1 10.26,38.2 U5.2 10.16,38.87 v1(9.7,39.32)
  Bottom Layer w0.508: U9.31 10.24,38.78 v1(9.7,39.32)
$1I45112\PHASE_U: length 9.9
  Top Layer w0.508: v1(5.13,57.35) 4.78,57 4.78,56.35 3.99,55.56 3.99,53.4 3.73,53.14 U7.4 3.73,51.4 v1(4.26,50.88)
  Bottom Layer w0.508: Q11.3 3.97,58.52 R8.2 ; C7.1 4.19,50.94 v1(4.26,50.88)
  vias: v1(5,58.14) v1(5.87,58.11) v1(5.89,57.23)
